# EAGLE design Arduino_4_Layers_TEST (EAGLE 9.6.2)

## Sheet 1 of 3
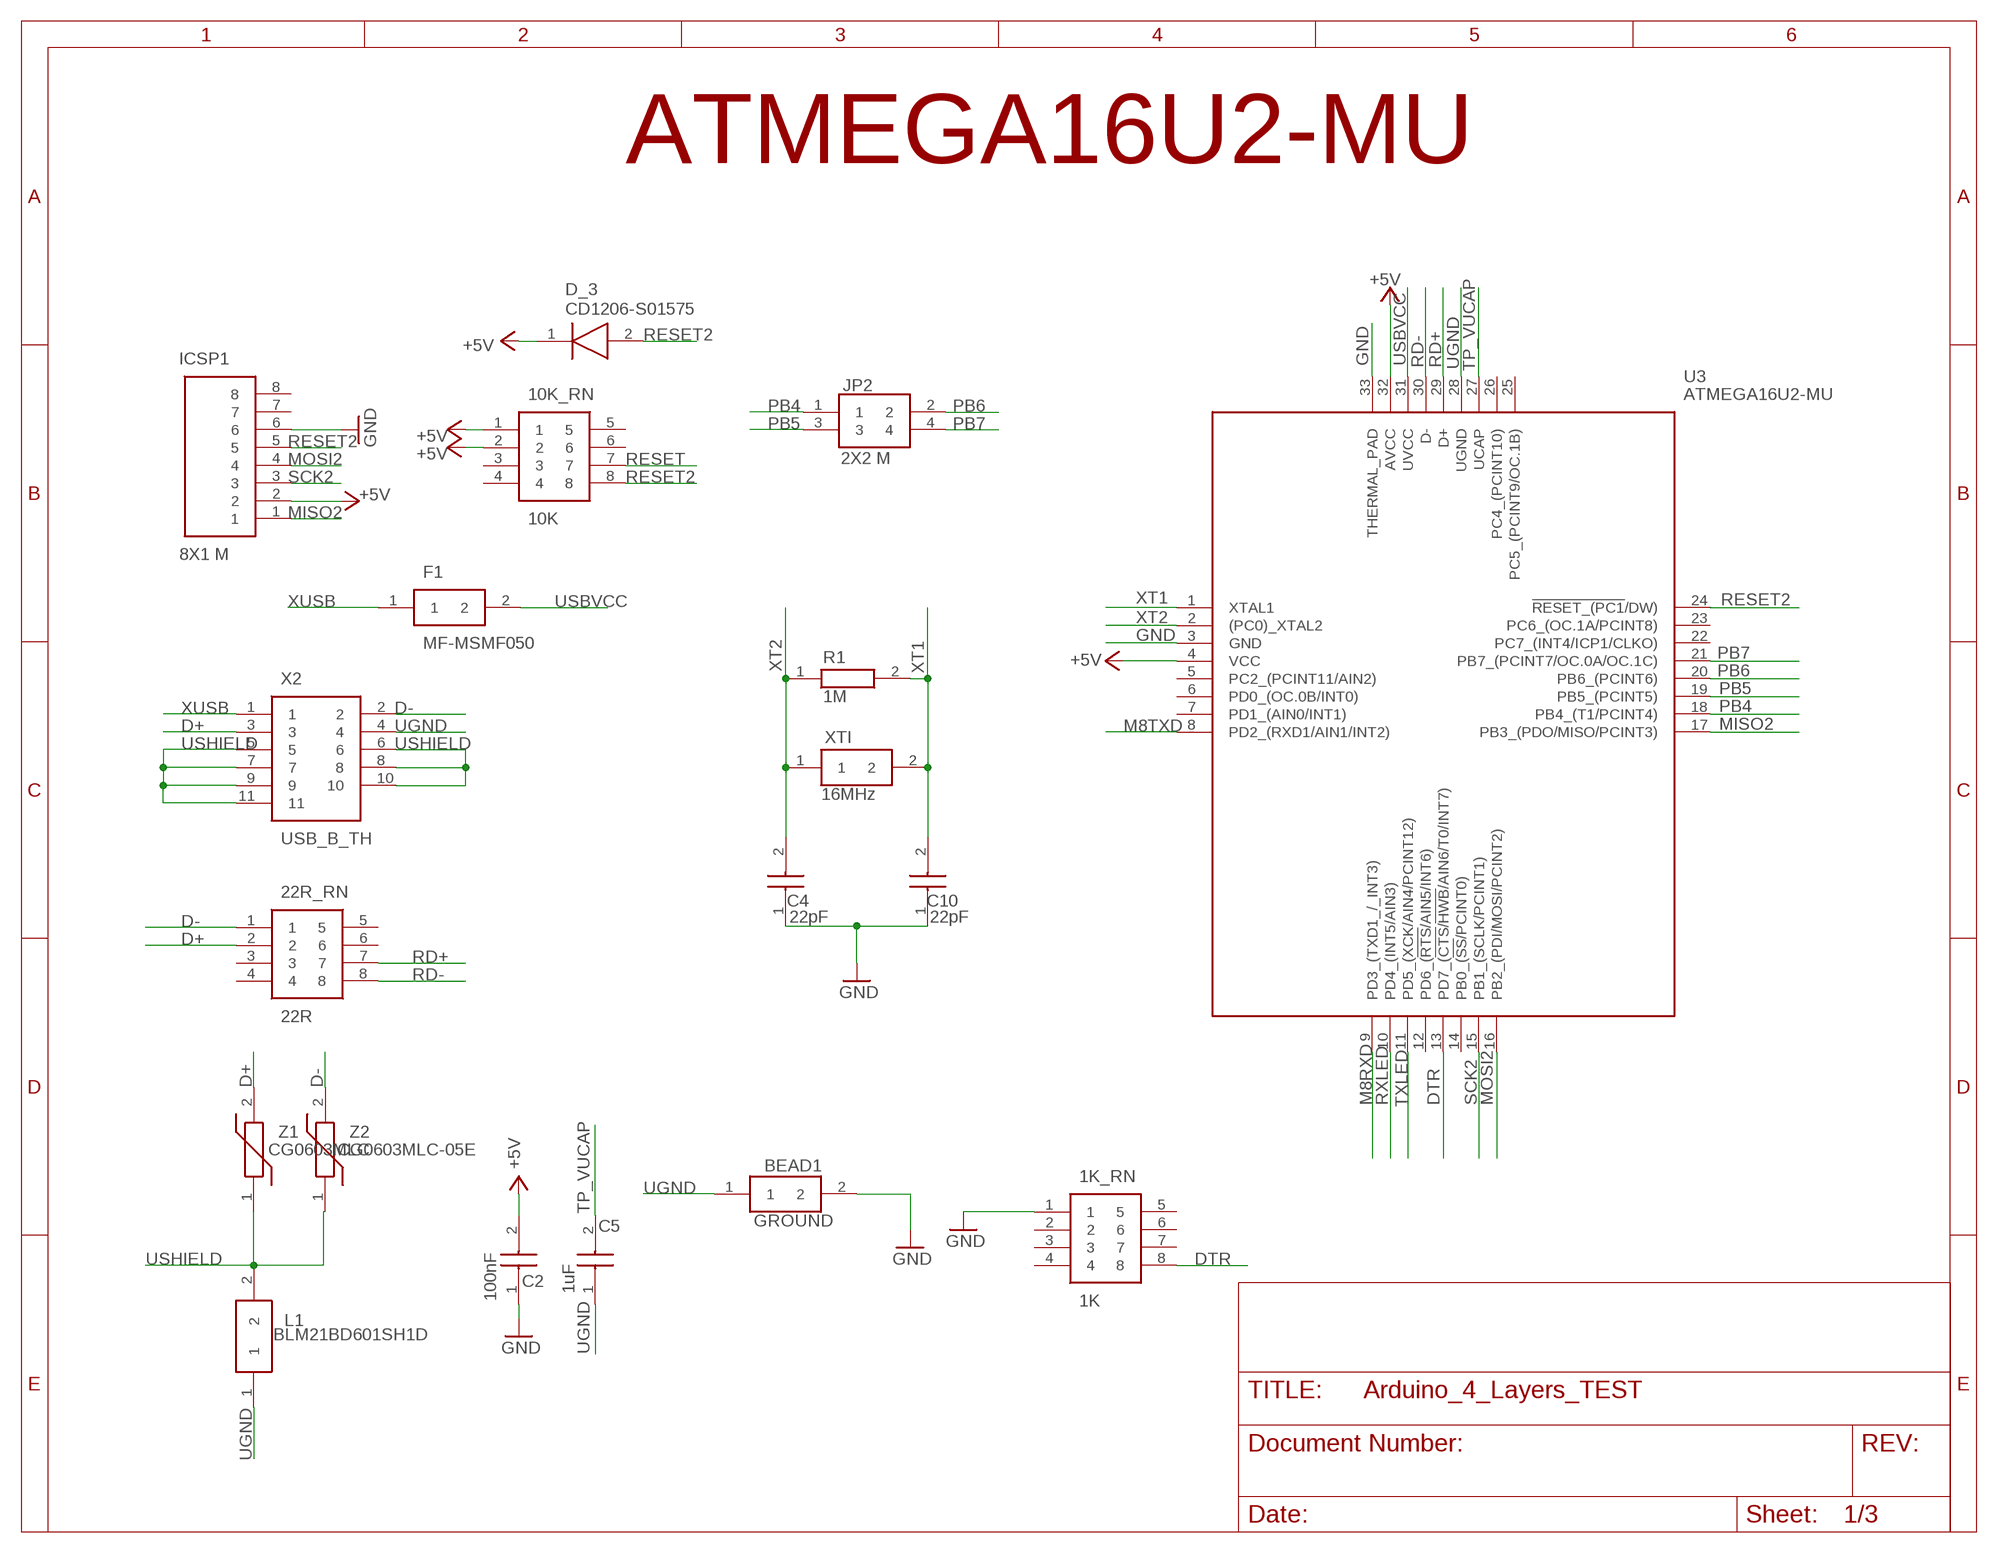
[diagram p0: schematic, sheet 1]

### Parts
1K_RN  1K  CAY10-220J4LF  [CAY10-XXXJ4]
10K_RN  10K  CAY10-220J4LF  [CAY10-XXXJ4]
22R_RN  22R  CAY10-220J4LF  [CAY10-XXXJ4]
BEAD1  GROUND  BLM21BD601SH1D  [BEADC2012X105N]
C2  100nF  0805Y0500104KXT  [CAPC2012X130N]
C4  22pF  GRM2165C1H220JZ01D  [CAPC2012X70N]
C5  1uF  C2012C0G2A103J125AA  [CAPC2012X145N]
C10  22pF  GRM2165C1H220JZ01D  [CAPC2012X70N]
D_3  CD1206-S01575  [DIOC3016X65N]
F1  MF-MSMF050  1812L050_30PR  [FUSC4632X75N]
ICSP1  8X1 M  90120-0768  [HDRV8W90P0X254_1X8_2032X249X56]
JP2  2X2 M  5-146256-2  [HDRV4W77P254_2X2_467X488X821P]
L1  BLM21BD601SH1D  [BEADC2012X105N]
R1  1M  CPF0603B1M0E1  [RESC1608X55N]
U3  ATMEGA16U2-MU  [QFN50P500X500X100-33N]
X2  USB_B_TH  1734035-1  [17340351]
XTI  16MHz  445I35D16M00000  [MODEL-445]
Z1  CG0603MLC  CG0603MLC-05E  [VARC1608X55N]
Z2  CG0603MLC-05E  [VARC1608X55N]

### Nets
+5V: 10K_RN.1 10K_RN.2 C2.2 D_3.1(K) ICSP1.2 U3.4(VCC) U3.32(AVCC) ; also sheet 2,3
D+: 22R_RN.2 X2.3 Z1.2
D-: 22R_RN.1 X2.2 Z2.2
DTR: 1K_RN.8 U3.13(PD7_(!CTS!/!HWB!/AIN6/T0/INT7)) ; also sheet 2
GND: 1K_RN.1 BEAD1.2 C2.1 C4.1 C10.1 ICSP1.6 U3.3(GND) U3.33(THERMAL_PAD) ; also sheet 2,3
M8RXD: U3.9(PD3_(TXD1_/_INT3)) ; also sheet 2
M8TXD: U3.8(PD2_(RXD1/AIN1/INT2)) ; also sheet 2
MISO2: ICSP1.1 U3.17(PB3_(PDO/MISO/PCINT3))
MOSI2: ICSP1.4 U3.16(PB2_(PDI/MOSI/PCINT2))
PB4: JP2.1 U3.18(PB4_(T1/PCINT4))
PB5: JP2.3 U3.19(PB5_(PCINT5))
PB6: JP2.2 U3.20(PB6_(PCINT6))
PB7: JP2.4 U3.21(PB7_(PCINT7/OC.0A/OC.1C))
RD+: 22R_RN.7 U3.29(D+)
RD-: 22R_RN.8 U3.30(D-)
RESET: 10K_RN.7 ; also sheet 2,3
RESET2: 10K_RN.8 D_3.2(A) ICSP1.5 U3.24(!RESET_(PC1!/DW))
RXLED: U3.10(PD4_(INT5/AIN3)) ; also sheet 2
SCK2: ICSP1.3 U3.15(PB1_(SCLK/PCINT1))
TP_VUCAP: C5.2 U3.27(UCAP)
TXLED: U3.11(PD5_(XCK/AIN4/PCINT12)) ; also sheet 2
UGND: BEAD1.1 C5.1 L1.1 U3.28(UGND) X2.4
USBVCC: F1.2 U3.31(UVCC) ; also sheet 3
USHIELD: L1.2 X2.5 X2.6 X2.7 X2.8 X2.9 X2.10 X2.11 Z1.1 Z2.1
XT1: C10.2 R1.2 U3.1(XTAL1) XTI.2
XT2: C4.2 R1.1 U3.2((PC0)_XTAL2) XTI.1
XUSB: F1.1 X2.1
Unconnected: 1K_RN.2 1K_RN.3 1K_RN.4 1K_RN.5 1K_RN.6 1K_RN.7 10K_RN.3 10K_RN.4 10K_RN.5 10K_RN.6 22R_RN.3 22R_RN.4 22R_RN.5 22R_RN.6 ICSP1.7 ICSP1.8 U3.5(PC2_(PCINT11/AIN2)) U3.6(PD0_(OC.0B/INT0)) U3.7(PD1_(AIN0/INT1)) U3.12(PD6_(!RTS!/AIN5/INT6)) U3.14(PB0_(!SS!/PCINT0)) U3.22(PC7_(INT4/ICP1/CLKO)) U3.23(PC6_(OC.1A/PCINT8)) U3.25(PC5_(PCINT9/OC.1B)) U3.26(PC4_(PCINT10))

### Notes on the sheet
- ATMEGA16U2-MU

## Sheet 2 of 3
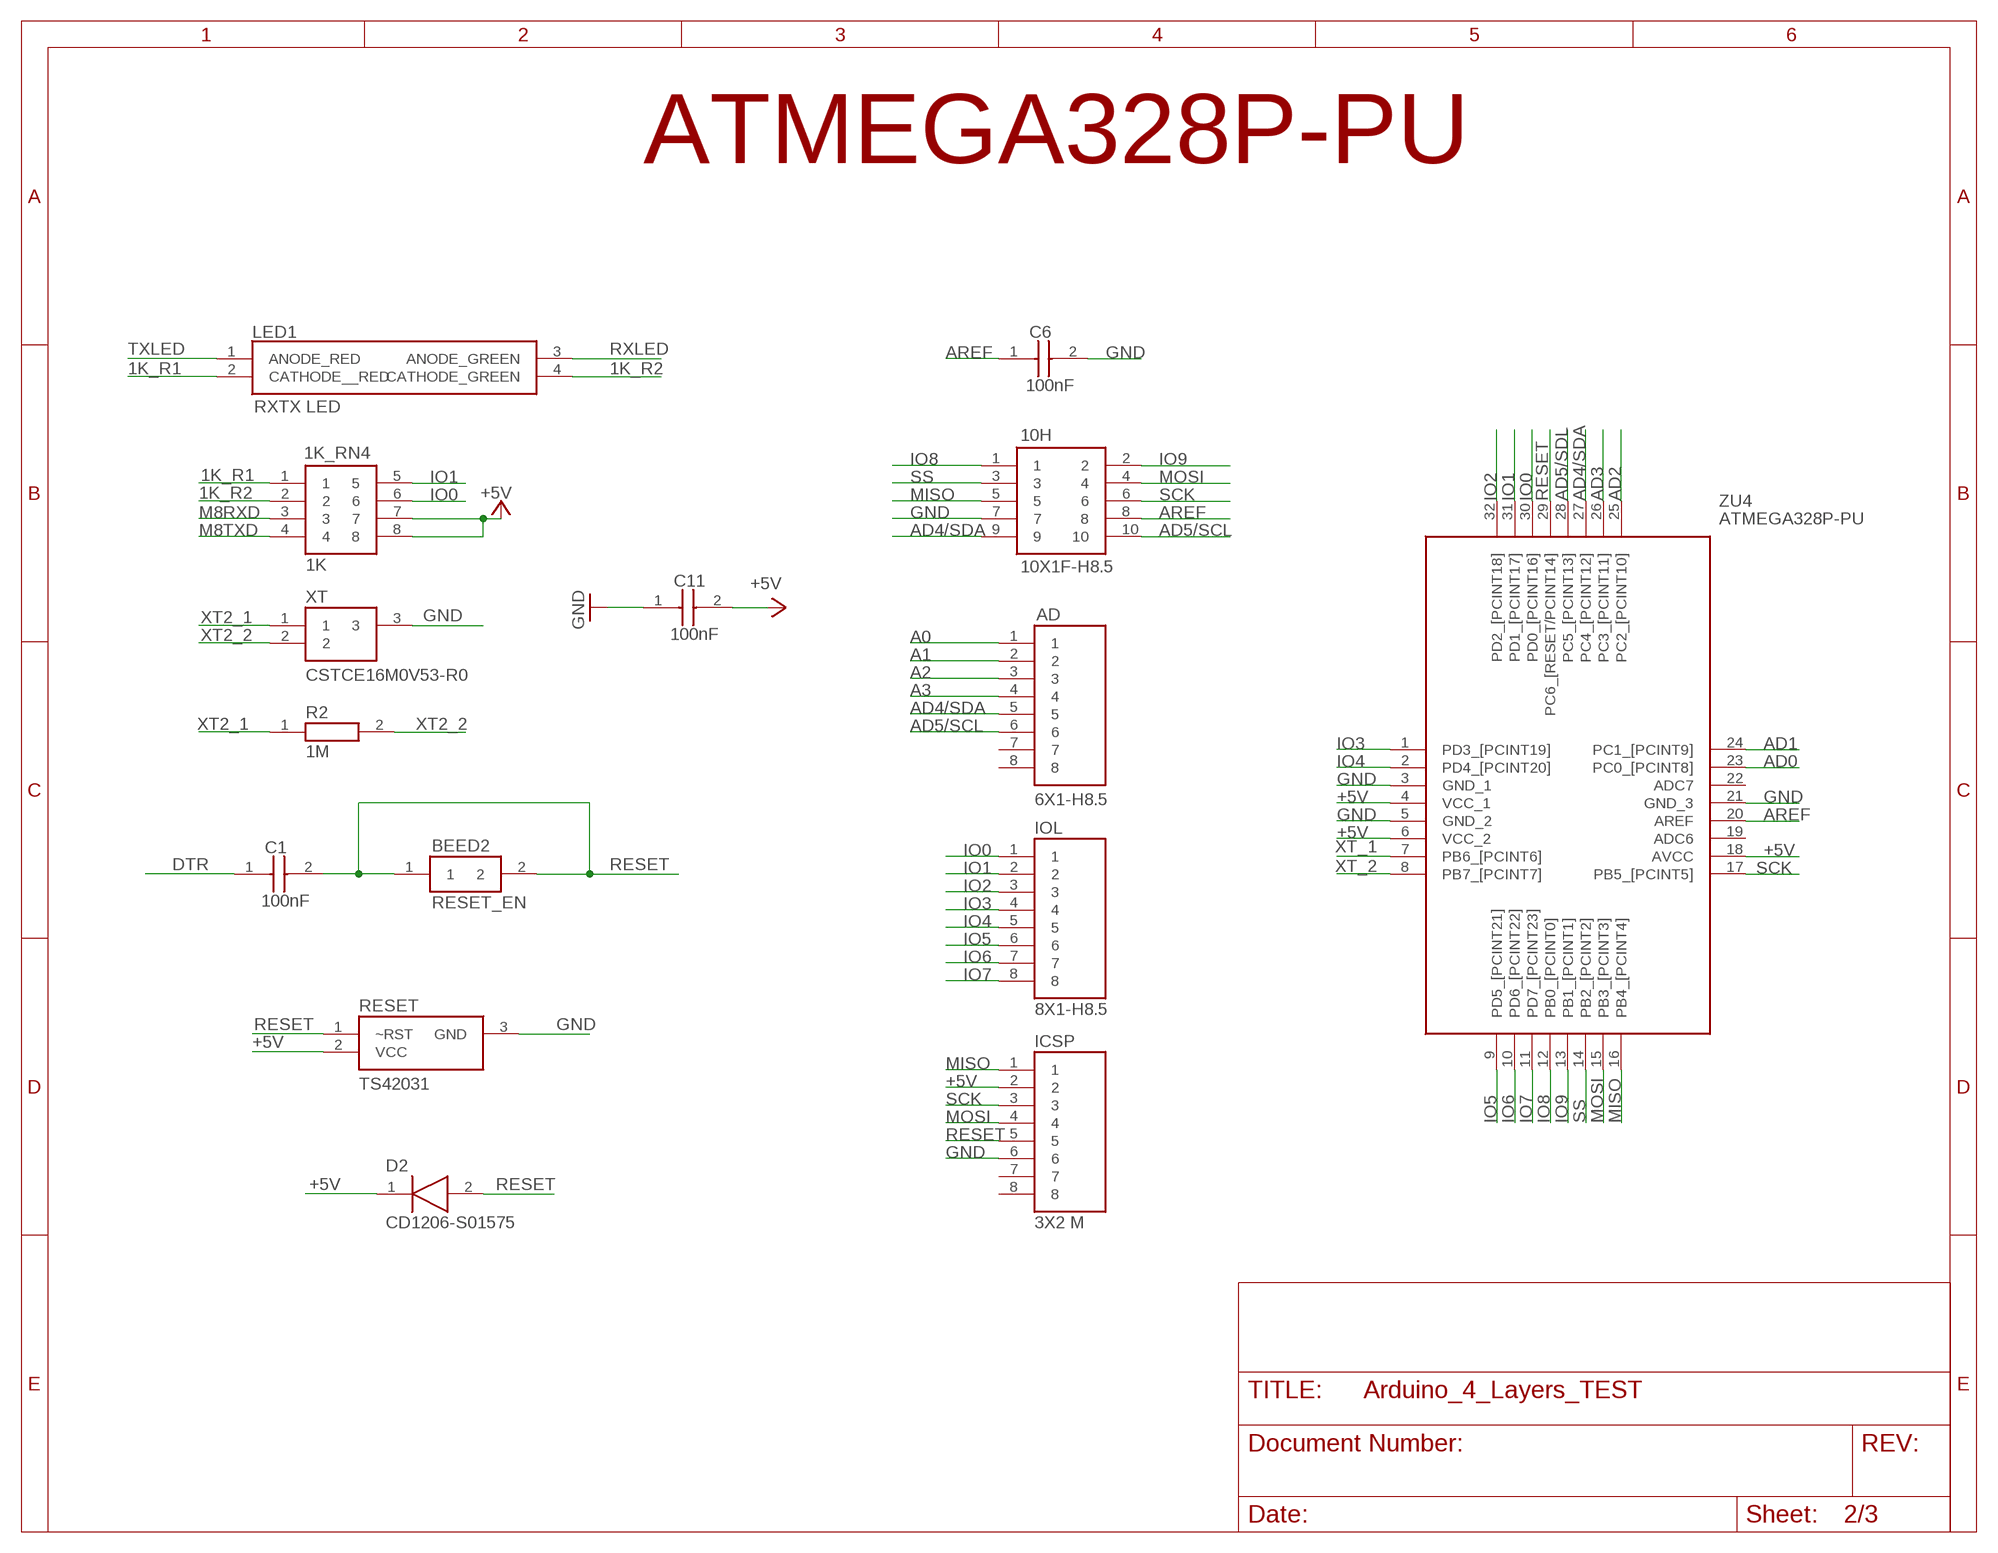
[diagram p1: schematic, sheet 2]

### Parts
1K_RN4  1K  CAY10-220J4LF  [CAY10-XXXJ4]
10H  10X1F-H8.5  FTMH-105-03-L-DV  [FTMH10503LDV]
AD  6X1-H8.5  90120-0768  [HDRV8W90P0X254_1X8_2032X249X56]
BEED2  RESET_EN  BLM21BD601SH1D  [BEADC2012X105N]
C1  100nF  0805Y0500104KXT  [CAPC2012X130N]
C6  100nF  0805Y0500104KXT  [CAPC2012X130N]
C11  100nF  0805Y0500104KXT  [CAPC2012X130N]
D2  CD1206-S01575  [DIOC3016X65N]
ICSP  3X2 M  90120-0768  [HDRV8W90P0X254_1X8_2032X249X56]
IOL  8X1-H8.5  90120-0768  [HDRV8W90P0X254_1X8_2032X249X56]
LED1  RXTX LED  SML-522MU8WT86  [SML522MD8WT86]
R2  1M  CPF0603B1M0E1  [RESC1608X55N]
RESET  TS42031  DS1818R-5+  [SOT95P240X110-3N]
XT  CSTCE16M0V53-R0  [CSTCE-V]
ZU4  ATMEGA328P-PU  ATMEGA328P-AU  [QFP80P900X900X120-32N]

### Nets
1K_R1: 1K_RN4.1 LED1.2(CATHODE__RED)
1K_R2: 1K_RN4.2 LED1.4(CATHODE_GREEN)
+5V: 1K_RN4.7 1K_RN4.8 C11.2 D2.1(K) ICSP.2 RESET.2(VCC) ZU4.4(VCC_1) ZU4.6(VCC_2) ZU4.18(AVCC) ; also sheet 1,3
A0: AD.1
A1: AD.2
A2: AD.3
A3: AD.4
AD0: ZU4.23(PC0_[PCINT8])
AD1: ZU4.24(PC1_[PCINT9])
AD2: ZU4.25(PC2_[PCINT10])
AD3: ZU4.26(PC3_[PCINT11])
AD4/SDA: 10H.9 AD.5 ZU4.27(PC4_[PCINT12])
AD5/SCL: 10H.10 AD.6
AD5/SDL: ZU4.28(PC5_[PCINT13])
AREF: 10H.8 C6.1 ZU4.20(AREF)
DTR: C1.1 ; also sheet 1
GND: 10H.7 C6.2 C11.1 ICSP.6 RESET.3(GND) XT.3 ZU4.3(GND_1) ZU4.5(GND_2) ZU4.21(GND_3) ; also sheet 1,3
IO0: 1K_RN4.6 IOL.1 ZU4.30(PD0_[PCINT16])
IO1: 1K_RN4.5 IOL.2 ZU4.31(PD1_[PCINT17])
IO2: IOL.3 ZU4.32(PD2_[PCINT18])
IO3: IOL.4 ZU4.1(PD3_[PCINT19])
IO4: IOL.5 ZU4.2(PD4_[PCINT20])
IO5: IOL.6 ZU4.9(PD5_[PCINT21])
IO6: IOL.7 ZU4.10(PD6_[PCINT22])
IO7: IOL.8 ZU4.11(PD7_[PCINT23])
IO8: 10H.1 ZU4.12(PB0_[PCINT0])
IO9: 10H.2 ZU4.13(PB1_[PCINT1])
M8RXD: 1K_RN4.3 ; also sheet 1
M8TXD: 1K_RN4.4 ; also sheet 1
MISO: 10H.5 ICSP.1 ZU4.16(PB4_[PCINT4])
MOSI: 10H.4 ICSP.4 ZU4.15(PB3_[PCINT3])
RESET: BEED2.1 BEED2.2 C1.2 D2.2(A) ICSP.5 RESET.1(~RST) ZU4.29(PC6_[RESET/PCINT14]) ; also sheet 1,3
RXLED: LED1.3(ANODE_GREEN) ; also sheet 1
SCK: 10H.6 ICSP.3 ZU4.17(PB5_[PCINT5]) ; also sheet 3
SS: 10H.3 ZU4.14(PB2_[PCINT2])
TXLED: LED1.1(ANODE_RED) ; also sheet 1
XT2_1: R2.1 XT.1
XT2_2: R2.2 XT.2
XT_1: ZU4.7(PB6_[PCINT6])
XT_2: ZU4.8(PB7_[PCINT7])
Unconnected: AD.7 AD.8 ICSP.7 ICSP.8 ZU4.19(ADC6) ZU4.22(ADC7)

### Notes on the sheet
- ATMEGA328P-PU

## Sheet 3 of 3
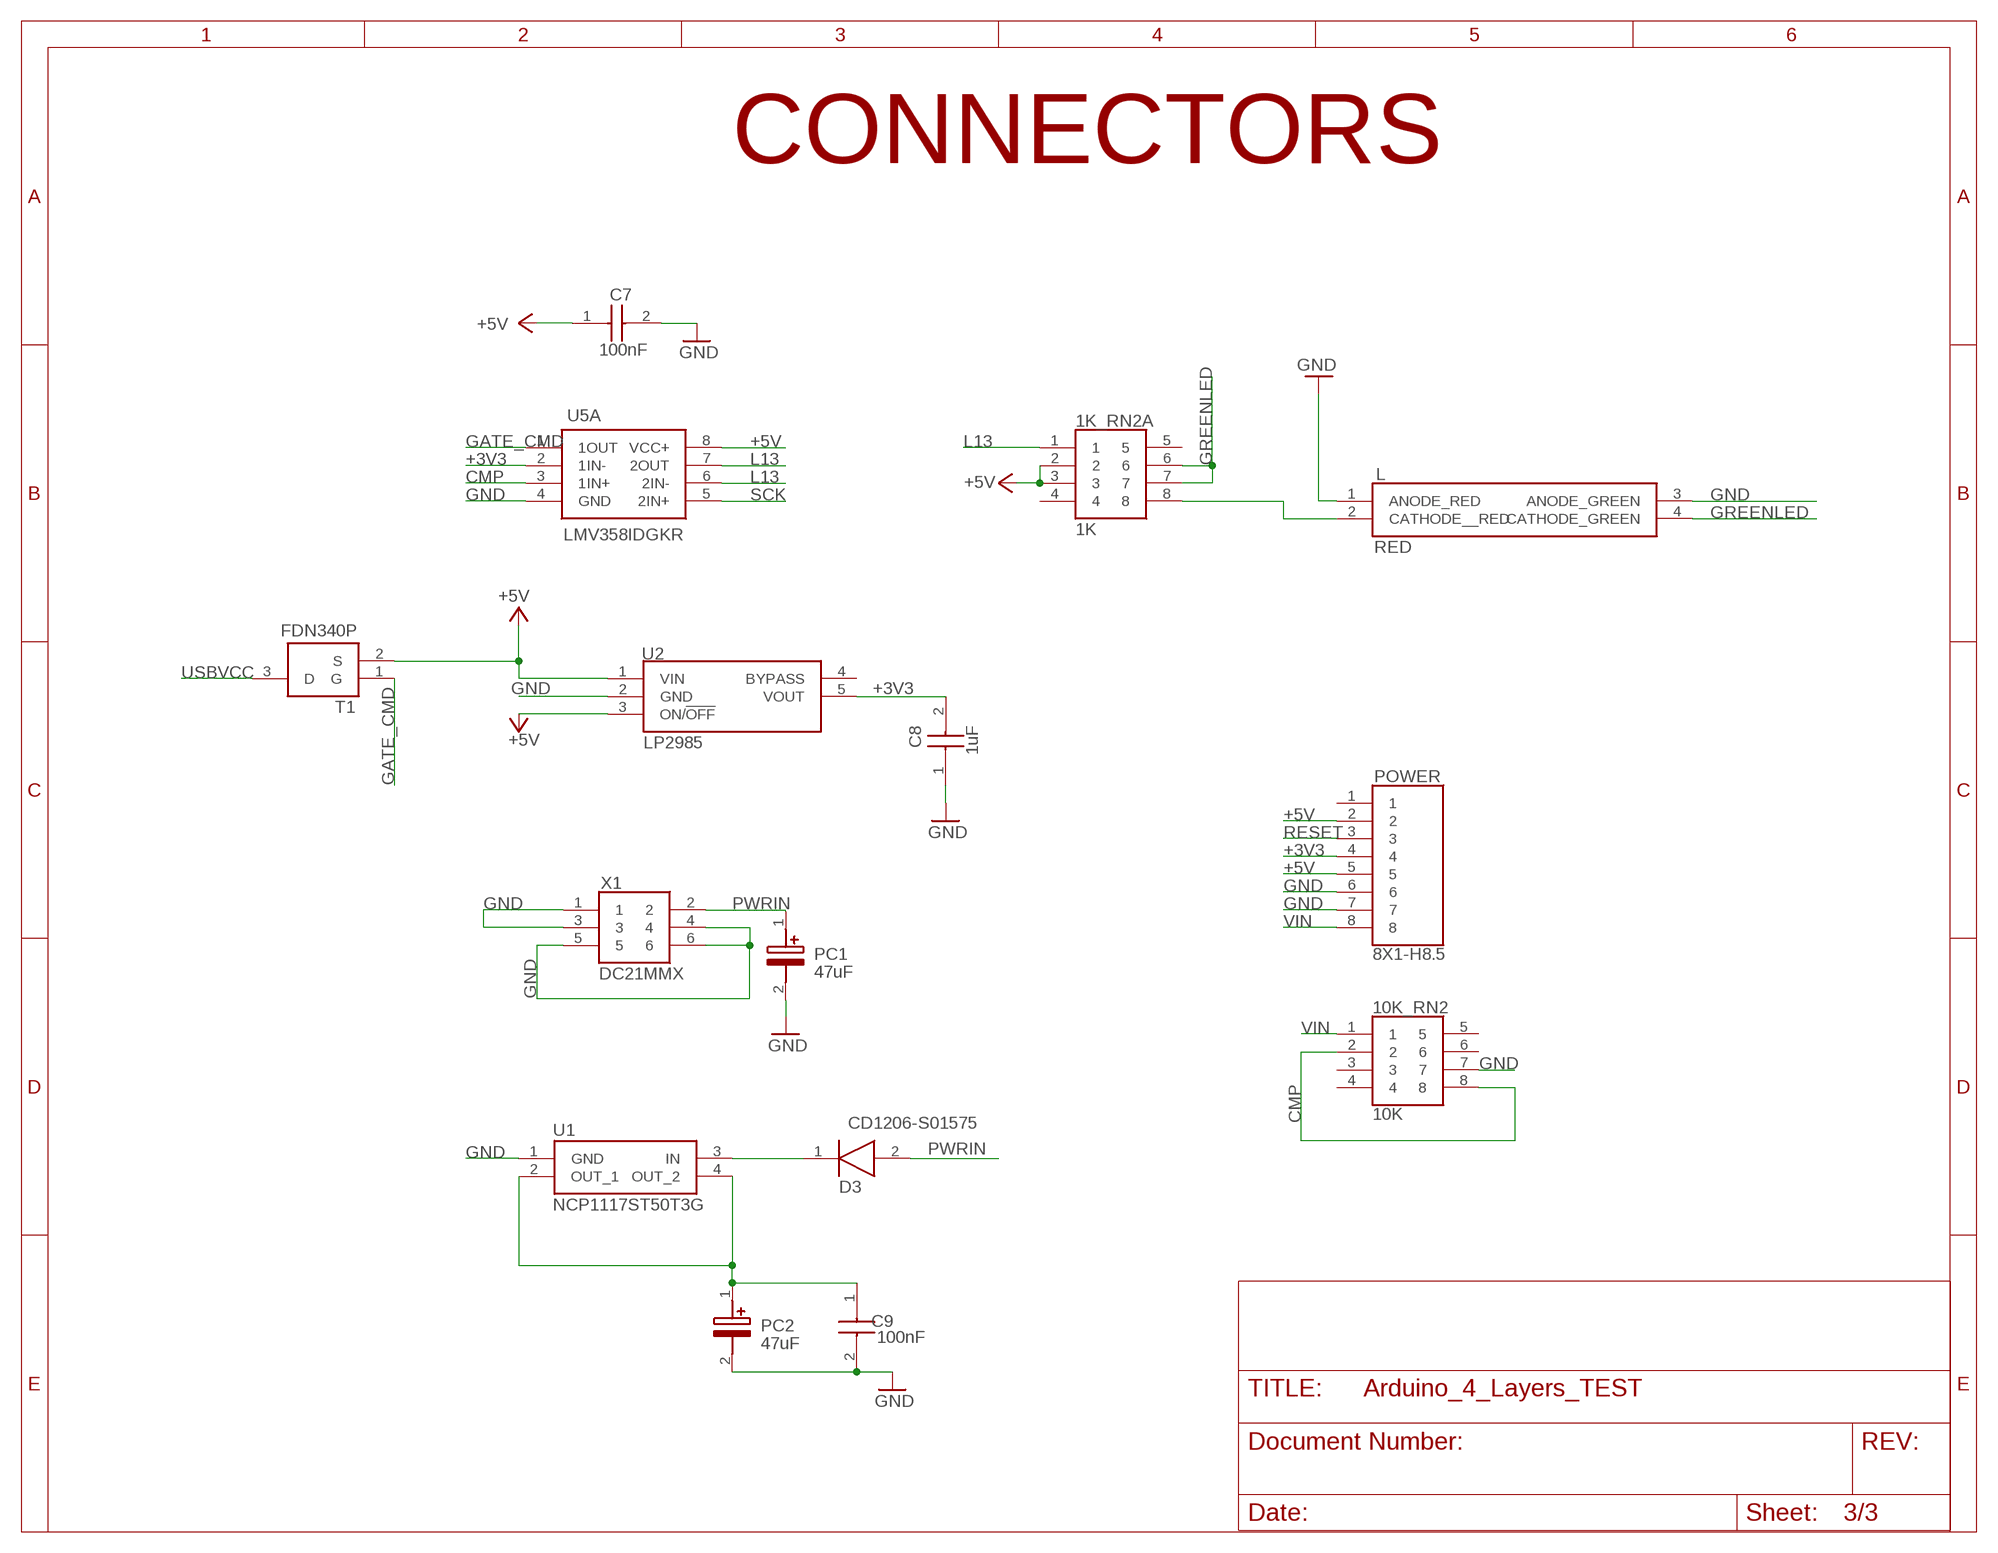
[diagram p2: schematic, sheet 3]

### Parts
1K_RN2A  1K  CAY10-220J4LF  [CAY10-XXXJ4]
10K_RN2  10K  CAY10-220J4LF  [CAY10-XXXJ4]
C7  100nF  0805Y0500104KXT  [CAPC2012X130N]
C8  1uF  C2012C0G2A103J125AA  [CAPC2012X145N]
C9  100nF  0805Y0500104KXT  [CAPC2012X130N]
D3  CD1206-S01575  [DIOC3016X65N]
L  RED  SML-522MU8WT86  [SML522MD8WT86]
PC1  47uF  EEE-FT1V470AR  [CAPAE530X610N]
PC2  47uF  EEE-FT1V470AR  [CAPAE530X610N]
POWER  8X1-H8.5  90120-0768  [HDRV8W90P0X254_1X8_2032X249X56]
T1  FDN340P  [SOT95P251X112-3N]
U1  NCP1117ST50T3G  [SOT230P700X180-4N]
U2  LP2985  LP2985-33DBVR  [SOT95P280X145-5N]
U5A  LMV358IDGKR  [SOP65P490X110-8N]
X1  DC21MMX  USB-B-S-RA  [USBBSRA]

### Nets
+3V3: C8.2 POWER.4 U2.5(VOUT) U5A.2(1IN-)
+5V: 1K_RN2A.2 1K_RN2A.3 C7.1 POWER.2 POWER.5 T1.2(S) U2.1(VIN) U2.3(ON/!OFF) U5A.8(VCC+) ; also sheet 1,2
CMP: 10K_RN2.2 10K_RN2.8 U5A.3(1IN+)
GATE_CMD: T1.1(G) U5A.1(1OUT)
GND: 10K_RN2.7 C7.2 C8.1 C9.2 L.1(ANODE_RED) L.3(ANODE_GREEN) PC1.2(-) PC2.2(-) POWER.6 POWER.7 U1.1(GND) U2.2(GND) U5A.4(GND) X1.1 X1.3 X1.4 X1.5 X1.6 ; also sheet 1,2
GREENLED: 1K_RN2A.6 1K_RN2A.7 L.4(CATHODE_GREEN)
L13: 1K_RN2A.1 U5A.6(2IN-) U5A.7(2OUT)
N$3: 1K_RN2A.8 L.2(CATHODE__RED)
N$4: D3.1(K) U1.3(IN)
N$6: C9.1 PC2.1(+) U1.2(OUT_1) U1.4(OUT_2)
PWRIN: D3.2(A) PC1.1(+) X1.2
RESET: POWER.3 ; also sheet 1,2
SCK: U5A.5(2IN+) ; also sheet 2
USBVCC: T1.3(D) ; also sheet 1
VIN: 10K_RN2.1 POWER.8
Unconnected: 1K_RN2A.4 1K_RN2A.5 10K_RN2.3 10K_RN2.4 10K_RN2.5 10K_RN2.6 POWER.1 U2.4(BYPASS)

### Notes on the sheet
- CONNECTORS

## Library data of the parts
1K_RN 1K_RN2A 1K_RN4 10K_RN 10K_RN2 22R_RN = CAY10-220J4LF:CAY10-220J4LF: CAY10 convex chip resistor array,22R Bourns CAY10 Series 22 5% Isolated SMT Resistor Array, 4 Resistors, 0.125W total 0804 package Convex Source: Datasheet <http://docs-emea.rs-online.com/webdocs/064e/0900766b8064e463.pdf>; ALLIED_NUMBER: 70276318; ALLIED_PRICE-STOCK: https://www.alliedelec.com/bourns-cay10-220j4lf/70276318/; DESCRIPTION: CAY10 convex chip resistor array,22R Bourns CAY10 Series 22 5% Isolated SMT Resistor Array, 4 Resistors, 0.125W total 0804 package Convex; HEIGHT: mm; MANUFACTURER_NAME: Bourns; MANUFACTURER_PART_NUMBER: CAY10-220J4LF; MOUSER_PART_NUMBER: 652-CAY10-220J4LF; MOUSER_PRICE-STOCK: https://www.mouser.com/Search/Refine.aspx?Keyword=652-CAY10-220J4LF; RS_PART_NUMBER: 1674746; RS_PRICE-STOCK: http://uk.rs-online.com/web/p/products/1674746
10H = FTMH-105-03-L-DV:FTMH-105-03-L-DV: Header 1mm PCB SMT vertical 10way Samtec FTMH Series, 1mm Pitch 10 Way 2 Row Straight Pin Header, Surface Mount, Solder Termination Source: Datasheet <http://suddendocs.samtec.com/prints/ftmh-1xx-xx-xx-dv-xx-mkt.pdf>; DESCRIPTION: Header 1mm PCB SMT vertical 10way Samtec FTMH Series, 1mm Pitch 10 Way 2 Row Straight Pin Header, Surface Mount, Solder Termination; HEIGHT: mm; MANUFACTURER_NAME: SAMTEC; MANUFACTURER_PART_NUMBER: FTMH-105-03-L-DV; MOUSER_PART_NUMBER: 200-FTMH10503LDV; MOUSER_PRICE-STOCK: https://www.mouser.com/Search/Refine.aspx?Keyword=200-FTMH10503LDV; RS_PART_NUMBER: 7668984P; RS_PRICE-STOCK: http://uk.rs-online.com/web/p/products/7668984P
AD ICSP ICSP1 IOL POWER = 90120-0768:90120-0768: 8 way single row straight header Molex C-GRID III Series, Series Number 90120, 2.54mm Pitch 8 Way 1 Row Straight Pin Header, Through Hole Source: Datasheet <http://www.molex.com/molex/products/datasheet.jsp?part=active/0901200768_PCB_HEADERS.xml>; ALLIED_NUMBER: 70372836; ALLIED_PRICE-STOCK: https://www.alliedelec.com/molex-incorporated-90120-0768/70372836/; DESCRIPTION: 8 way single row straight header Molex C-GRID III Series, Series Number 90120, 2.54mm Pitch 8 Way 1 Row Straight Pin Header, Through Hole; HEIGHT: 5.6mm; MANUFACTURER_NAME: Molex; MANUFACTURER_PART_NUMBER: 90120-0768; MOUSER_PART_NUMBER: 538-90120-0768; MOUSER_PRICE-STOCK: https://www.mouser.com/Search/Refine.aspx?Keyword=538-90120-0768; RS_PART_NUMBER: 1671900; RS_PRICE-STOCK: http://uk.rs-online.com/web/p/products/1671900
BEAD1 BEED2 L1 = BLM21BD601SH1D:BLM21BD601SH1D: Chip Ferrite Bead 600R 0805 300mA 1LN Source: Datasheet <https://componentsearchengine.com/Datasheets/2/BLM21BD601SH1D.pdf>; DESCRIPTION: Chip Ferrite Bead 600R 0805 300mA 1LN; HEIGHT: 1.05mm; MANUFACTURER_NAME: Murata Electronics; MANUFACTURER_PART_NUMBER: BLM21BD601SH1D; MOUSER_PART_NUMBER: 81-BLM21BD601SH1D; MOUSER_PRICE-STOCK: https://www.mouser.com/Search/Refine.aspx?Keyword=81-BLM21BD601SH1D; RS_PART_NUMBER: 1048541P; RS_PRICE-STOCK: http://uk.rs-online.com/web/p/products/1048541P
C1 C2 C6 C7 C9 C11 = 0805Y0500104KXT:0805Y0500104KXT: Syfer Technology 0805 Flexicap 100nF Ceramic Multilayer Capacitor, 50 V, +125C, X7R Dielectric, 10% SMD Source: Datasheet <http://docs-emea.rs-online.com/webdocs/119d/0900766b8119d7bc.pdf>; DESCRIPTION: Syfer Technology 0805 Flexicap 100nF Ceramic Multilayer Capacitor, 50 V, +125C, X7R Dielectric, 10% SMD; HEIGHT: 1.3mm; MANUFACTURER_NAME: Syfer; MANUFACTURER_PART_NUMBER: 0805Y0500104KXT; MOUSER_PART_NUMBER: 7738389P; MOUSER_PRICE-STOCK: http://uk.rs-online.com/web/p/products/7738389P; RS_PART_NUMBER: 7738389P; RS_PRICE-STOCK: http://uk.rs-online.com/web/p/products/7738389P
C4 C10 = GRM2165C1H220JZ01D:GRM2165C1H220JZ01D: MURATA - GRM2165C1H220JZ01D - CAP, MLCC, C0G/NP0, 22PF, 50V, 0805 Source: Datasheet <http://www.murata.com/~/media/webrenewal/support/library/catalog/products/capacitor/mlcc/c02e.pdf>; DESCRIPTION: MURATA - GRM2165C1H220JZ01D - CAP, MLCC, C0G/NP0, 22PF, 50V, 0805; HEIGHT: 0.7mm; MANUFACTURER_NAME: Murata Electronics; MANUFACTURER_PART_NUMBER: GRM2165C1H220JZ01D; MOUSER_PART_NUMBER: 81-GRM2165C1H220JZ; MOUSER_PRICE-STOCK: https://www.mouser.com/Search/Refine.aspx?Keyword=81-GRM2165C1H220JZ; RS_PART_NUMBER: 7236243; RS_PRICE-STOCK: http://uk.rs-online.com/web/p/products/7236243
C5 C8 = C2012C0G2A103J125AA:C2012C0G2A103J125AA: Multilayer Ceramic Capacitors MLCC - SMD/SMT 0805 C0G 100volts 0.01uF 5% 1.25mm Source: Datasheet <https://product.tdk.com/info/en/catalog/datasheets/mlcc_commercial_midvoltage_en.pdf>; DESCRIPTION: Multilayer Ceramic Capacitors MLCC - SMD/SMT 0805 C0G 100volts 0.01uF 5% 1.25mm; HEIGHT: 1.45mm; MANUFACTURER_NAME: TDK; MANUFACTURER_PART_NUMBER: C2012C0G2A103J125AA; MOUSER_PART_NUMBER: 810-C2012C0G2A103JAA; MOUSER_PRICE-STOCK: https://www.mouser.com/Search/Refine.aspx?Keyword=810-C2012C0G2A103JAA
D2 D3 D_3 = CD1206-S01575:CD1206-S01575: Diode Switching 100V 0.15A 4ns SMD1206 Bourns CD1206-S01575 Switching Diode, 150mA, 100V, 4ns, 2-Pin 1206 Source: Datasheet <http://docs-emea.rs-online.com/webdocs/1189/0900766b811897a9.pdf>; ALLIED_NUMBER: 70154675; ALLIED_PRICE-STOCK: http://www.alliedelec.com/bourns-cd1206-s01575/70154675/; DESCRIPTION: Diode Switching 100V 0.15A 4ns SMD1206 Bourns CD1206-S01575 Switching Diode, 150mA, 100V, 4ns, 2-Pin 1206; HEIGHT: 0.65mm; MANUFACTURER_NAME: Bourns; MANUFACTURER_PART_NUMBER: CD1206-S01575; MOUSER_PART_NUMBER: 652-CD1206-S01575; MOUSER_PRICE-STOCK: https://www.mouser.com/Search/Refine.aspx?Keyword=652-CD1206-S01575; RS_PART_NUMBER: 1775431; RS_PRICE-STOCK: http://uk.rs-online.com/web/p/products/1775431
F1 = 1812L050_30PR:1812L050_30PR: Littelfuse 0.5A Resettable Surface Mount Fuse, 30V dc Source: Datasheet <https://www.arrow.com/en/products/1812l05030pr/littelfuse>; DESCRIPTION: Littelfuse 0.5A Resettable Surface Mount Fuse, 30V dc; HEIGHT: 0.75mm; MANUFACTURER_NAME: LITTELFUSE; MANUFACTURER_PART_NUMBER: 1812L050/30PR; MOUSER_PART_NUMBER: 576-1812L050/30PR; MOUSER_PRICE-STOCK: https://www.mouser.com/Search/Refine.aspx?Keyword=576-1812L050%2F30PR; RS_PART_NUMBER: 8951631P; RS_PRICE-STOCK: http://uk.rs-online.com/web/p/products/8951631P
JP2 = 5-146256-2:5-146256-2: AMP - TE CONNECTIVITY - 5-146256-2 - CONNECTOR, HEADER, 4 POSITION, 2ROWS, 2.54MM Source: Datasheet <http://www.mouser.com/ds/2/418/NG_CD_146256_H-649289.pdf>; ALLIED_NUMBER: 70085239; ALLIED_PRICE-STOCK: https://www.alliedelec.com/te-connectivity-5-146256-2/70085239/; DESCRIPTION: AMP - TE CONNECTIVITY - 5-146256-2 - CONNECTOR, HEADER, 4 POSITION, 2ROWS, 2.54MM; HEIGHT: 8.21mm; MANUFACTURER_NAME: TE Connectivity; MANUFACTURER_PART_NUMBER: 5-146256-2; MOUSER_PART_NUMBER: 571-5-146256-2; MOUSER_PRICE-STOCK: https://www.mouser.com/Search/Refine.aspx?Keyword=571-5-146256-2; RS_PART_NUMBER: 7972955; RS_PRICE-STOCK: http://uk.rs-online.com/web/p/products/7972955
L LED1 = SML-522MU8WT86:SML-522MU8WT86: Dual color mini-mold Chip LED: ROHM's chip LED lineup consists of standard type,top-view type, side-view type and reverse-mount type. Source: Datasheet <https://www.rohm.com/datasheet/SML-522MU8W/sml-52-e>; DESCRIPTION: Dual color mini-mold Chip LED: ROHM's chip LED lineup consists of standard type,top-view type, side-view type and reverse-mount type.; HEIGHT: 0mm; MANUFACTURER_NAME: ROHM Semiconductor; MANUFACTURER_PART_NUMBER: SML-522MU8WT86; MOUSER_PART_NUMBER: 755-SML-522MU8WT86; MOUSER_PRICE-STOCK: https://www.mouser.com/Search/Refine.aspx?Keyword=755-SML-522MU8WT86; RS_PART_NUMBER: 1682468; RS_PRICE-STOCK: http://uk.rs-online.com/web/p/products/1682468
PC1 PC2 = EEE-FT1V470AR:EEE-FT1V470AR: Aluminum Electrolytic Capacitors - SMD 47uF 35volts 5x5.8mm SMD Source: Datasheet <https://industrial.panasonic.com/cdbs/www-data/pdf/RDE0000/ABA0000C1240.pdf>; ALLIED_NUMBER: 70258388; ALLIED_PRICE-STOCK: https://www.alliedelec.com/panasonic-eee-ft1v470ar/70258388/; DESCRIPTION: Aluminum Electrolytic Capacitors - SMD 47uF 35volts 5x5.8mm SMD; HEIGHT: 6.1mm; MANUFACTURER_NAME: Panasonic; MANUFACTURER_PART_NUMBER: EEE-FT1V470AR; MOUSER_PART_NUMBER: 667-EEE-FT1V470AR; MOUSER_PRICE-STOCK: https://www.mouser.com/Search/Refine.aspx?Keyword=667-EEE-FT1V470AR
R1 R2 = CPF0603B1M0E1:CPF0603B1M0E1: TE CONNECTIVITY - CPF0603B1M0E1 - RES, THIN FILM, 1M, 0.1%, 0.063W, 0603 Source: Datasheet <http://www.farnell.com/datasheets/1786775.pdf>; DESCRIPTION: TE CONNECTIVITY - CPF0603B1M0E1 - RES, THIN FILM, 1M, 0.1%, 0.063W, 0603; HEIGHT: 0.55mm; MANUFACTURER_NAME: TE Connectivity; MANUFACTURER_PART_NUMBER: CPF0603B1M0E1; MOUSER_PART_NUMBER: 279-CPF0603B1M0E1; MOUSER_PRICE-STOCK: https://www.mouser.com/Search/Refine.aspx?Keyword=279-CPF0603B1M0E1
RESET = DS1818R-5+:DS1818R-5+: 3.3V EconoReset with Pushbutton Source: Datasheet; DESCRIPTION: 3.3V EconoReset with Pushbutton; HEIGHT: mm; MANUFACTURER_NAME: Maxim Integrated; MANUFACTURER_PART_NUMBER: DS1818R-5+
T1 = FDN340P:FDN340P: FDN340P, P-channel MOSFET Transistor 2 A 20 V, 3-Pin SuperSOT Source: Datasheet <http://docs-emea.rs-online.com/webdocs/0d23/0900766b80d23111.pdf>; DESCRIPTION: FDN340P, P-channel MOSFET Transistor 2 A 20 V, 3-Pin SuperSOT; HEIGHT: 1.12mm; MANUFACTURER_NAME: Fairchild Semiconductor; MANUFACTURER_PART_NUMBER: FDN340P; MOUSER_PART_NUMBER: 512-FDN340P; MOUSER_PRICE-STOCK: https://www.mouser.com/Search/Refine.aspx?Keyword=512-FDN340P; RS_PART_NUMBER: 6710435P; RS_PRICE-STOCK: http://uk.rs-online.com/web/p/products/6710435P
U1 = NCP1117ST50T3G:NCP1117ST50T3G: ON SEMICONDUCTOR - NCP1117ST50T3G - LDO, REG, 20VIN, 1A, 5V, 1%, SOT223-3 Source: Datasheet <http://www.onsemi.com/pub/Collateral/NCP1117-D.PDF>; ALLIED_NUMBER: 70466898; ALLIED_PRICE-STOCK: http://www.alliedelec.com/on-semiconductor-ncp1117st50t3g/70466898/; DESCRIPTION: ON SEMICONDUCTOR - NCP1117ST50T3G - LDO, REG, 20VIN, 1A, 5V, 1%, SOT223-3; HEIGHT: 1.8mm; MANUFACTURER_NAME: ON Semiconductor; MANUFACTURER_PART_NUMBER: NCP1117ST50T3G; MOUSER_PART_NUMBER: 863-NCP1117ST50T3G; MOUSER_PRICE-STOCK: https://www.mouser.com/Search/Refine.aspx?Keyword=863-NCP1117ST50T3G; RS_PART_NUMBER: 8022130P; RS_PRICE-STOCK: http://uk.rs-online.com/web/p/products/8022130P
U2 = LP2985-33DBVR:LP2985-33DBVR: 150-mA Low-noise Low-dropout Regulator With Shutdown Source: Datasheet <http://www.ti.com/lit/gpn/lp2985>; DESCRIPTION: 150-mA Low-noise Low-dropout Regulator With Shutdown; HEIGHT: 1.45mm; MANUFACTURER_NAME: Texas Instruments; MANUFACTURER_PART_NUMBER: LP2985-33DBVR; MOUSER_PART_NUMBER: 595-LP2985-33DBVR; MOUSER_PRICE-STOCK: https://www.mouser.com/Search/Refine.aspx?Keyword=595-LP2985-33DBVR
U3 = ATMEGA16U2-MU:ATMEGA16U2-MU: 8-bit Microcontrollers - MCU AVR USB 8K FLASH AVR USB 16K FLASH Source: Datasheet <http://ww1.microchip.com/downloads/en/DeviceDoc/doc7799.pdf>; DESCRIPTION: 8-bit Microcontrollers - MCU AVR USB 8K FLASH AVR USB 16K FLASH; HEIGHT: 1mm; MANUFACTURER_NAME: Microchip; MANUFACTURER_PART_NUMBER: ATMEGA16U2-MU; MOUSER_PART_NUMBER: 556-ATMEGA16U2-MU; MOUSER_PRICE-STOCK: https://www.mouser.com/Search/Refine.aspx?Keyword=556-ATMEGA16U2-MU; RS_PART_NUMBER: 1717746; RS_PRICE-STOCK: http://uk.rs-online.com/web/p/products/1717746
U5A = LMV358IDGKR:LMV358IDGKR: OP Amp Dual GP R-R O/P 5.5V 8-Pin MSOP Texas Instruments LMV358IDGKR, Dual Op Amp, 1MHz CMOS, Rail to Rail, 3 V, 5 V, 8-Pin MSOP Source: Datasheet <http://www.ti.com/lit/ds/symlink/lmv358.pdf>; DESCRIPTION: OP Amp Dual GP R-R O/P 5.5V 8-Pin MSOP Texas Instruments LMV358IDGKR, Dual Op Amp, 1MHz CMOS, Rail to Rail, 3 V, 5 V, 8-Pin MSOP; HEIGHT: 1.1mm; MANUFACTURER_NAME: Texas Instruments; MANUFACTURER_PART_NUMBER: LMV358IDGKR; MOUSER_PART_NUMBER: 595-LMV358IDGKR; MOUSER_PRICE-STOCK: https://www.mouser.com/Search/Refine.aspx?Keyword=595-LMV358IDGKR; RS_PART_NUMBER: 1625114; RS_PRICE-STOCK: http://uk.rs-online.com/web/p/products/1625114
X1 = USB-B-S-RA:USB-B-S-RA: MULTICOMP - USB-B-S-RA - USB, 2.0 TYPE B, RECEPTACLE, TH Source: Datasheet <http://www.farnell.com/datasheets/1788391.pdf>; DESCRIPTION: MULTICOMP - USB-B-S-RA - USB, 2.0 TYPE B, RECEPTACLE, TH; HEIGHT: 10mm; MANUFACTURER_NAME: MULTICOMP; MANUFACTURER_PART_NUMBER: USB-B-S-RA
X2 = 1734035-1:1734035-1: AMP - TE CONNECTIVITY - 1734035-1. - MINI USB, 2.0 TYPE B, RECEPTACLE, SMT Source: Datasheet <http://www.te.com/commerce/DocumentDelivery/DDEController?Action=srchrtrv&DocNm=1734035&DocType=Customer Drawing&DocLang=English>; ALLIED_NUMBER: 70086812; ALLIED_PRICE-STOCK: https://www.alliedelec.com/te-connectivity-1734035-1/70086812/; DESCRIPTION: AMP - TE CONNECTIVITY - 1734035-1. - MINI USB, 2.0 TYPE B, RECEPTACLE, SMT; HEIGHT: 4mm; MANUFACTURER_NAME: TE Connectivity; MANUFACTURER_PART_NUMBER: 1734035-1; MOUSER_PART_NUMBER: 571-1734035-1; MOUSER_PRICE-STOCK: https://www.mouser.com/Search/Refine.aspx?Keyword=571-1734035-1
XT = CSTCE16M0V53-R0:CSTCE16M0V53-R0: Ceramic resonator SMT CSTCE 16.00MHz CSTCE16M0V53-R0, Ceramic Resonator, 16MHz Expander 15pF, 3-Pin Cap Chip, 3.2 x 1.3 x 0.9mm Source: Datasheet <http://uk.rs-online.com/web/p/products/6241077>; DESCRIPTION: Ceramic resonator SMT CSTCE 16.00MHz CSTCE16M0V53-R0, Ceramic Resonator, 16MHz Expander 15pF, 3-Pin Cap Chip, 3.2 x 1.3 x 0.9mm; HEIGHT: mm; MANUFACTURER_NAME: Murata Electronics; MANUFACTURER_PART_NUMBER: CSTCE16M0V53-R0; MOUSER_PART_NUMBER: 81-CSTCE16M0V53-R0; MOUSER_PRICE-STOCK: https://www.mouser.com/Search/Refine.aspx?Keyword=81-CSTCE16M0V53-R0; RS_PART_NUMBER: 7926524P; RS_PRICE-STOCK: http://uk.rs-online.com/web/p/products/7926524P
XTI = 445I35D16M00000:445I35D16M00000: Crystals 16MHz +/-30ppm 18pF -40C +85C Source: Datasheet <http://www.mouser.com/ds/2/96/008-0360-0-786290.pdf>; DESCRIPTION: Crystals 16MHz +/-30ppm 18pF -40C +85C; HEIGHT: mm; MANUFACTURER_NAME: CTS; MANUFACTURER_PART_NUMBER: 445I35D16M00000; MOUSER_PART_NUMBER: 774-445I35D16M00000; MOUSER_PRICE-STOCK: https://www.mouser.com/Search/Refine.aspx?Keyword=774-445I35D16M00000
Z1 Z2 = CG0603MLC-05E:CG0603MLC-05E: Varistor, ESD Protector, 5VDC,20V,0603 Bourns MLC Series Power Varistor 0.5pF 20V 0603 Case Source: Datasheet <http://www.farnell.com/datasheets/1785244.pdf>; ALLIED_NUMBER: 70153503; ALLIED_PRICE-STOCK: https://www.alliedelec.com/bourns-cg0603mlc-05e/70153503/; DESCRIPTION: Varistor, ESD Protector, 5VDC,20V,0603 Bourns MLC Series Power Varistor 0.5pF 20V 0603 Case; HEIGHT: 0.55mm; MANUFACTURER_NAME: Bourns; MANUFACTURER_PART_NUMBER: CG0603MLC-05E; MOUSER_PART_NUMBER: 652-CG0603MLC-05E; MOUSER_PRICE-STOCK: https://www.mouser.com/Search/Refine.aspx?Keyword=652-CG0603MLC-05E; RS_PART_NUMBER: 8518256; RS_PRICE-STOCK: http://uk.rs-online.com/web/p/products/8518256
ZU4 = ATMEGA328P-AU:ATMEGA328P-AU: MICROCHIP - ATMEGA328P-AU. - MICROCONTROLLER MCU, 8 BIT, ATMEGA, 20MHZ, TQFP-32 Source: Datasheet <https://componentsearchengine.com/Datasheets/2/ATMEGA328P-AU.pdf>; DESCRIPTION: MICROCHIP - ATMEGA328P-AU. - MICROCONTROLLER MCU, 8 BIT, ATMEGA, 20MHZ, TQFP-32; HEIGHT: 1.2mm; MANUFACTURER_NAME: Microchip; MANUFACTURER_PART_NUMBER: ATMEGA328P-AU; MOUSER_PART_NUMBER: 556-ATMEGA328P-AU; MOUSER_PRICE-STOCK: https://www.mouser.com/Search/Refine.aspx?Keyword=556-ATMEGA328P-AU; RS_PART_NUMBER: 1310271; RS_PRICE-STOCK: http://uk.rs-online.com/web/p/products/1310271

## Board
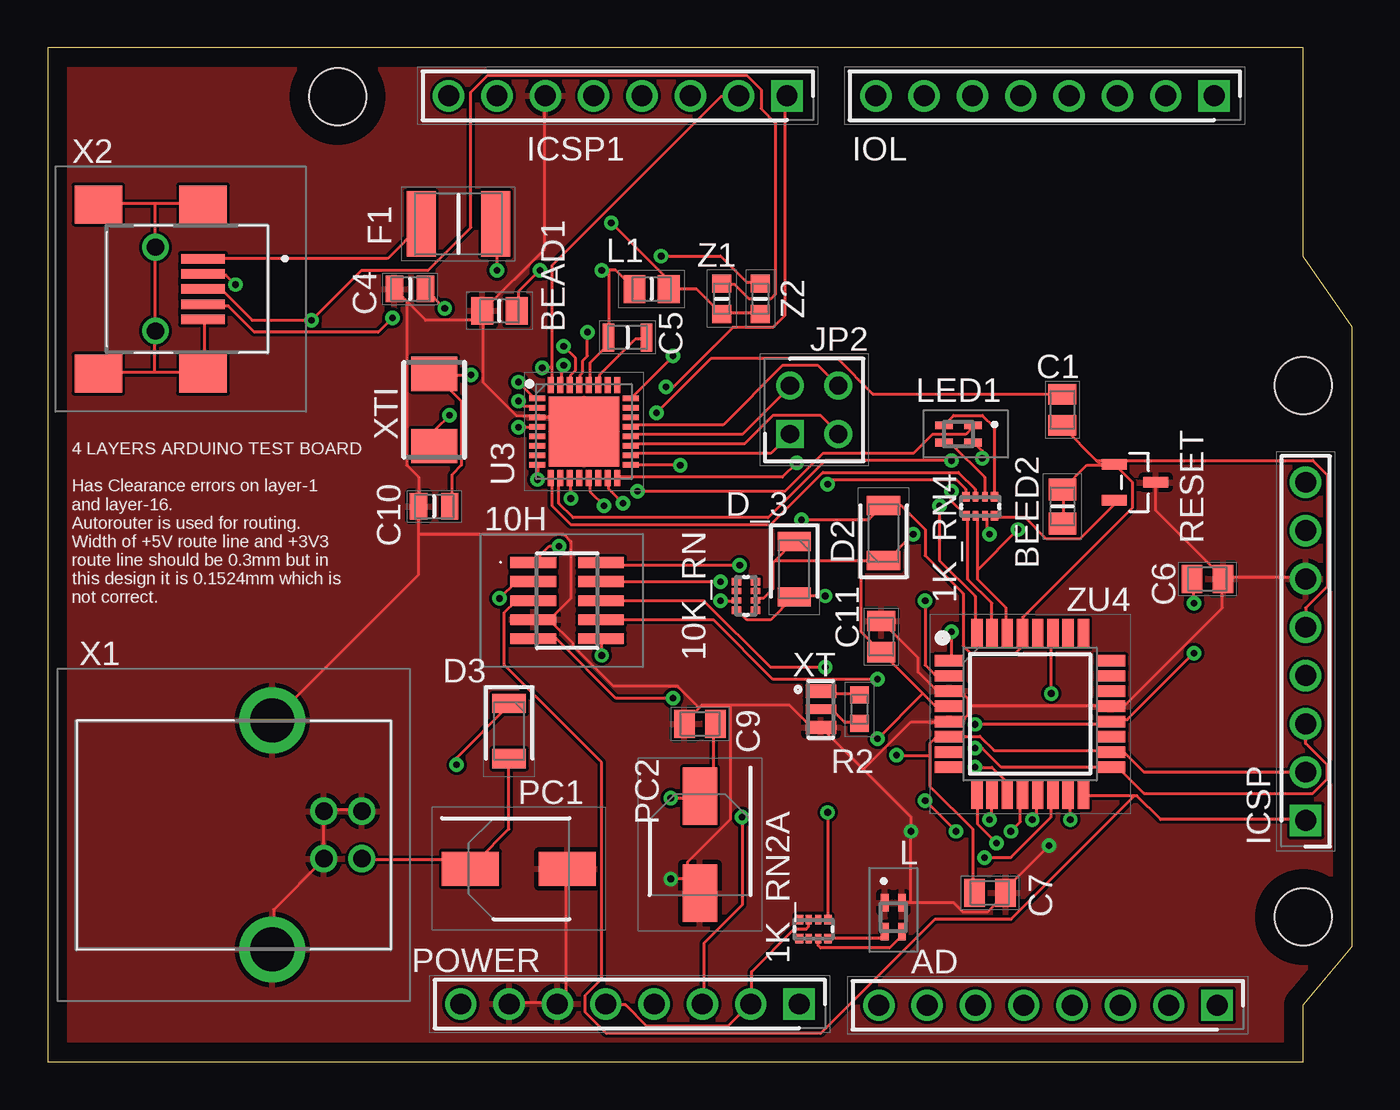
[diagram p3: board, top side]
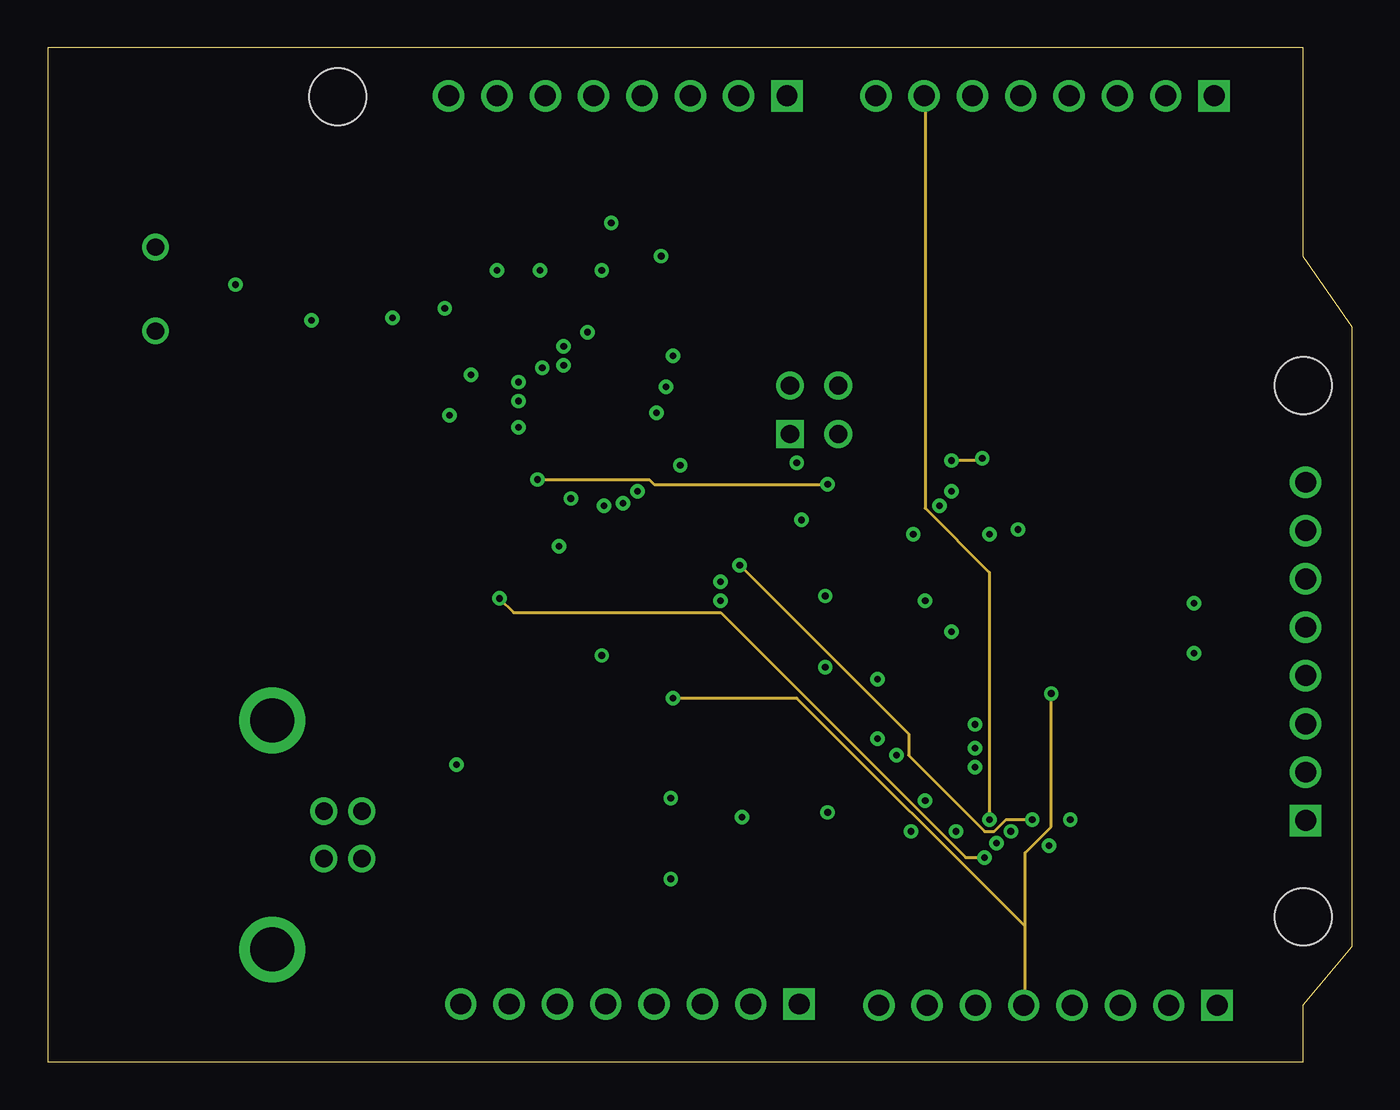
[diagram p4: board, inner layer Route2]
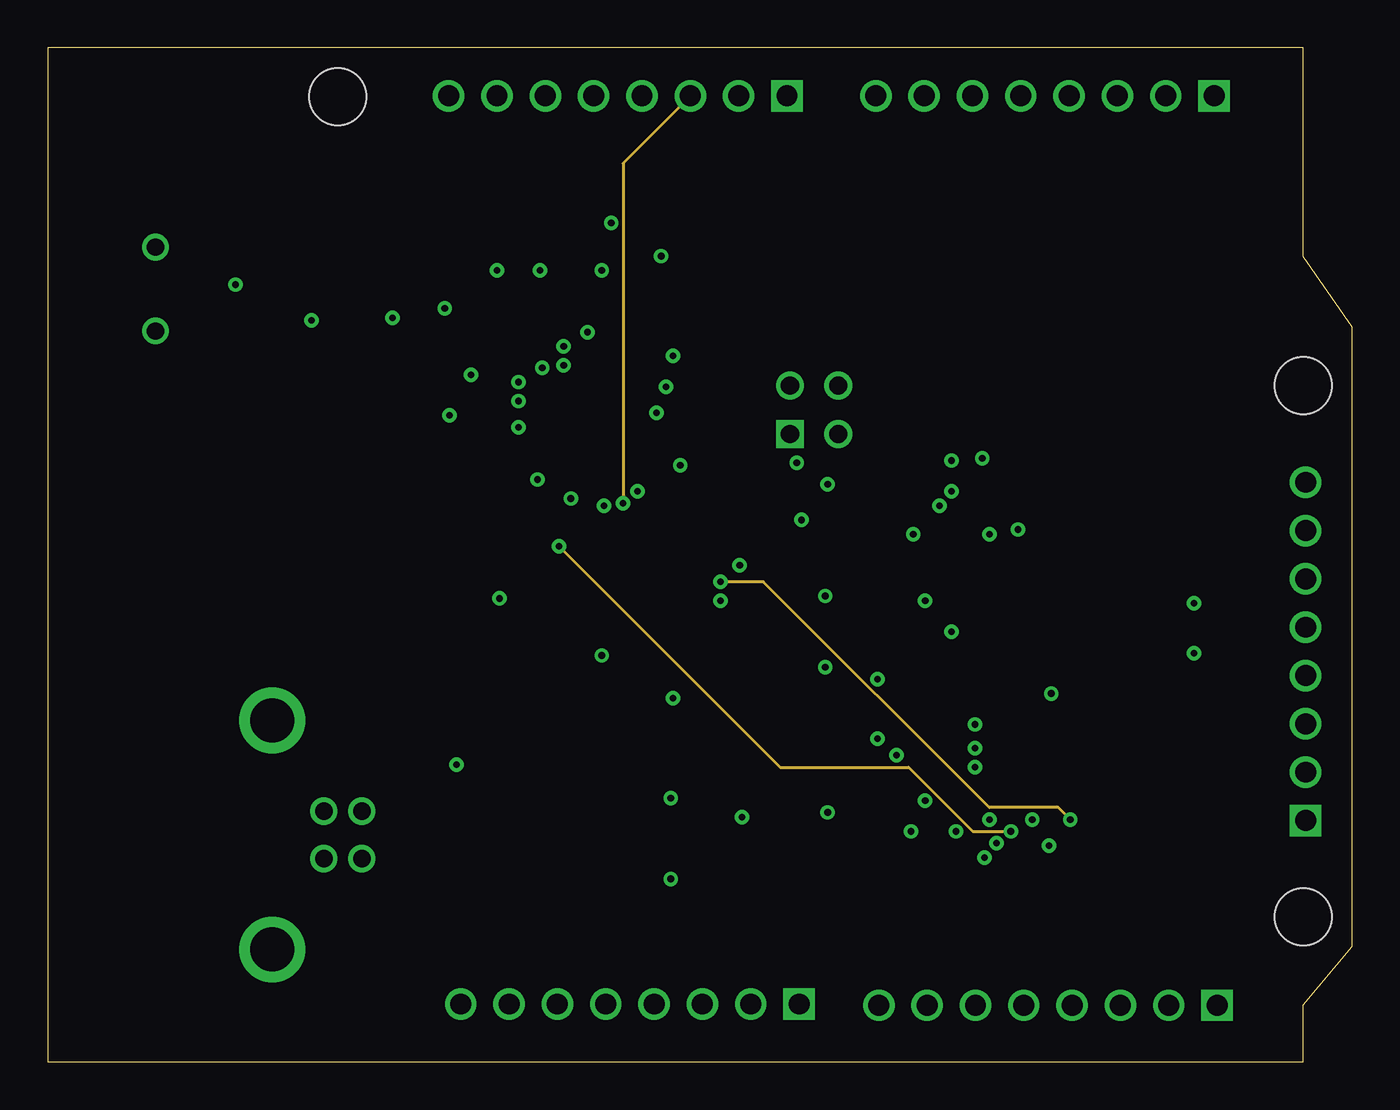
[diagram p5: board, inner layer Route15]
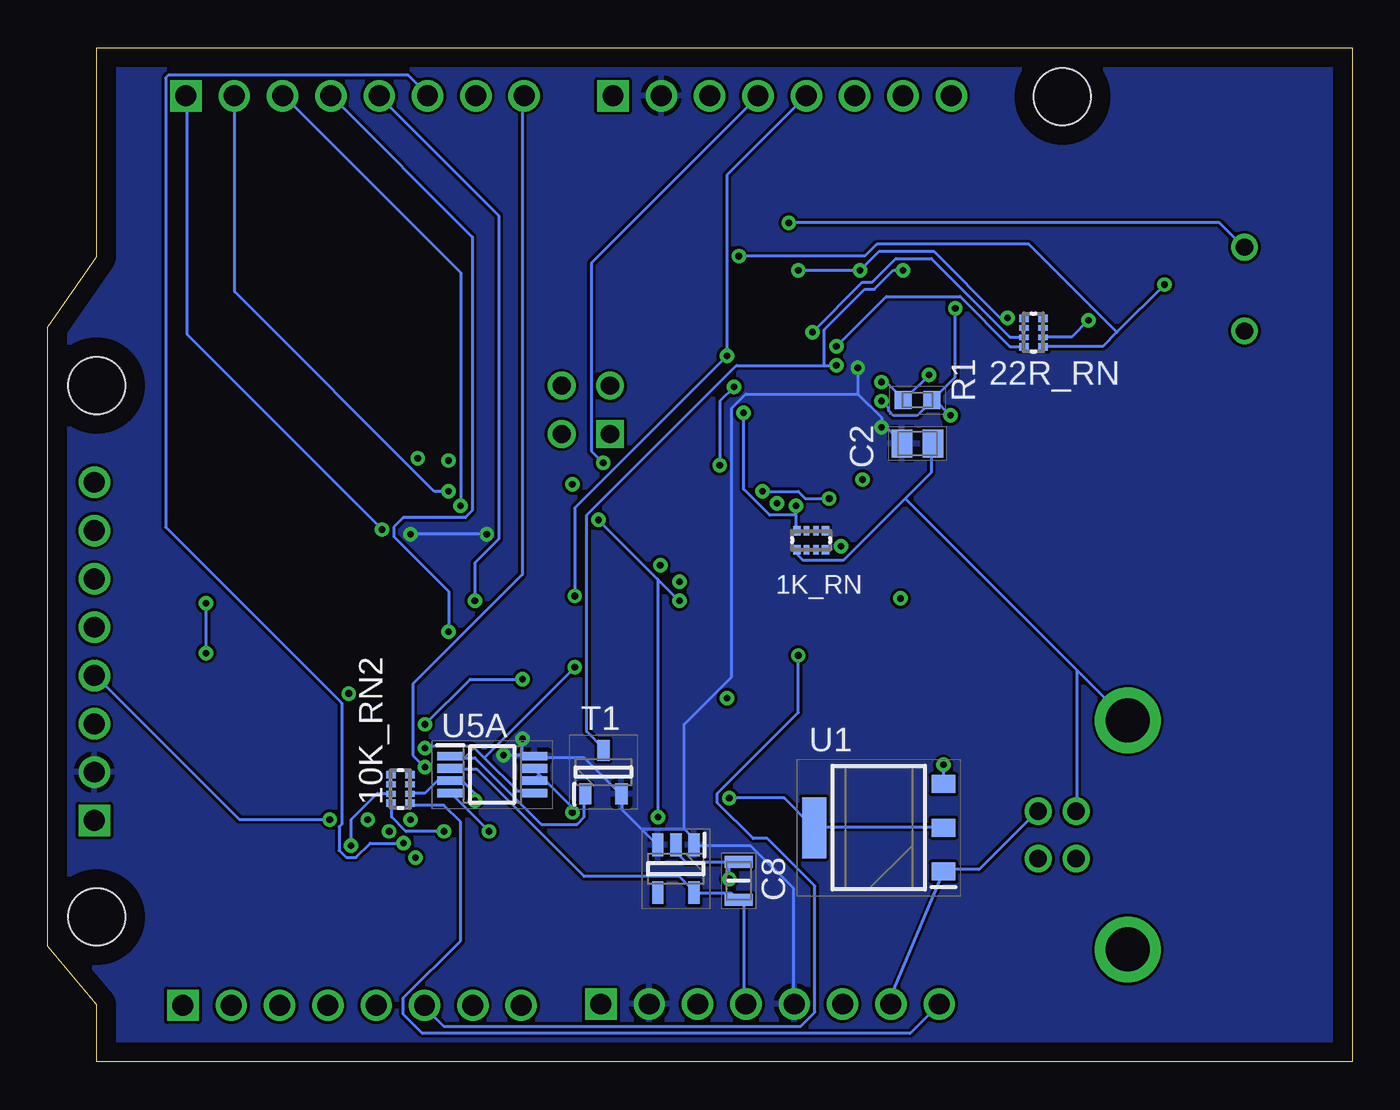
[diagram p6: board, bottom side, seen from below]

Size 68.58 x 53.34 mm. Coordinates in mm from the lower left corner, seen from the top.
Outline: 0,53.34 0,0 66,0 66,3 68.58,6.08 68.58,38.63 66,42.34 66,53.34 0,53.34
Copper layers (1+2*15+16): Top 0.036mm / dielectric 0.010159375mm / Route2 0.036mm / dielectric 10mil / Route15 0.036mm / dielectric 0.010159375mm / Bottom 0.036mm
Design rules "default *": minimum track width 6mil, minimum drill 0.35mm, track to track 6mil, track to pad 6mil, pad to pad 6mil, via to via 6mil, smd to smd 6mil, copper to edge 40mil, drill to drill 6mil, minimum pad ring 10mil, minimum via ring 8mil, stop-mask expansion 4mil, vias tented up to drill 0mil, thermal gap 10mil
Holes 3 mm at 66,35.56 66,7.62 15.24,50.76

### Footprints (pad centres in the part's own frame; a part is rotated, then mirrored left to right if it is on the bottom)
CAY10-XXXJ4 = smd 0.4 x 0.5: 1 -0.75,-0.5; 4 0.75,-0.5; 5 0.75,0.5; 8 -0.75,0.5 | smd 0.3 x 0.5: 2 -0.25,-0.5; 3 0.25,-0.5; 6 0.25,0.5; 7 -0.25,0.5
FTMH10503LDV = smd 0.56 x 2.41: 1 -2,-1.78; 2 -2,1.78; 3 -1,-1.78; 4 -1,1.78; 5 0,-1.78; 6 0,1.78; 7 1,-1.78; 8 1,1.78; 9 2,-1.78; 10 2,1.78
HDRV8W90P0X254_1X8_2032X249X56 = drill 1.1 pad 1.65 square: 1 0,0 | drill 1.1 pad 1.65: 2 2.54,0; 3 5.08,0; 4 7.62,0; 5 10.16,0; 6 12.7,0; 7 15.24,0; 8 17.78,0
BEADC2012X105N = smd 1.15 x 1.45: 1 -0.9,0; 2 0.9,0
CAPC2012X130N = smd 1.07 x 1.47: 1 -0.82,0; 2 0.82,0
CAPC2012X70N = smd 0.91 x 1.39: 1 -0.82,0; 2 0.82,0
CAPC2012X145N = smd 0.62 x 1.47: 1 -1,0; 2 1,0
DIOC3016X65N = smd 1 x 1.75: 1 -1.45,0; 2 1.45,0
FUSC4632X75N = smd 1.53 x 3.43: 1 -1.96,0; 2 1.96,0
HDRV4W77P254_2X2_467X488X821P = drill 0.95 pad 1.425 square: 1 0,0 | drill 0.95 pad 1.425: 2 0,2.54; 3 2.54,0; 4 2.54,2.54
SML522MD8WT86 = smd 0.925 x 0.4: 1 0.375,0.45; 2 -1.15,0.45; 3 0.375,-0.45; 4 -1.15,-0.45
CAPAE530X610N = smd 3 x 1.8: 1 -2.55,0; 2 2.55,0
RESC1608X55N = smd 0.9 x 0.95: 1 -0.75,0; 2 0.75,0
SOT95P240X110-3N = smd 1.321 x 0.559: 1 -1.092,0.94; 2 -1.092,-0.94; 3 1.092,0
SOT95P251X112-3N = smd 1.1 x 0.65: 1 -1.15,0.95; 2 -1.15,-0.95; 3 1.15,0
SOT230P700X180-4N = smd 1.25 x 0.95: 1 -3.4,2.3; 2 -3.4,0; 3 -3.4,-2.3 | smd 1.25 x 3.2: 4 3.4,0
SOT95P280X145-5N = smd 1.2 x 0.6: 1 -1.25,0.95; 2 -1.25,0; 3 -1.25,-0.95; 4 1.25,-0.95; 5 1.25,0.95
QFN50P500X500X100-33N = smd 0.85 x 0.3: 1 -2.45,1.75; 2 -2.45,1.25; 3 -2.45,0.75; 4 -2.45,0.25; 5 -2.45,-0.25; 6 -2.45,-0.75; 7 -2.45,-1.25; 8 -2.45,-1.75; 17 2.45,-1.75; 18 2.45,-1.25; 19 2.45,-0.75; 20 2.45,-0.25; 21 2.45,0.25; 22 2.45,0.75; 23 2.45,1.25; 24 2.45,1.75 | smd 0.3 x 0.85: 9 -1.75,-2.45; 10 -1.25,-2.45; 11 -0.75,-2.45; 12 -0.25,-2.45; 13 0.25,-2.45; 14 0.75,-2.45; 15 1.25,-2.45; 16 1.75,-2.45; 25 1.75,2.45; 26 1.25,2.45; 27 0.75,2.45; 28 0.25,2.45; 29 -0.25,2.45; 30 -0.75,2.45; 31 -1.25,2.45; 32 -1.75,2.45 | smd 3.7 x 3.7: 33 0,0
SOP65P490X110-8N = smd 1.4 x 0.45: 1 -2.2,0.975; 2 -2.2,0.325; 3 -2.2,-0.325; 4 -2.2,-0.975; 5 2.2,-0.975; 6 2.2,-0.325; 7 2.2,0.325; 8 2.2,0.975
USBBSRA = drill 0.92 pad 1.431: 1 -1.25,6.74; 2 1.25,6.74; 3 -1.25,4.74; 4 1.25,4.74 | drill 2.3 pad 3.45: 5 -6.02,2.03; 6 6.02,2.03
17340351 = smd 2.3 x 0.5: 1 0.55,1.6; 2 0.55,0.8; 3 0.55,0; 4 0.55,-0.8; 5 0.55,-1.6 | smd 2.5 x 2: 6 0.55,4.45; 7 0.55,-4.45; 8 -4.95,4.45; 9 -4.95,-4.45 | drill 0.9 pad 1.4: 10 -1.95,2.2; 11 -1.95,-2.2
CSTCE-V = smd 0.7 x 1.6: 1 0.95,0; 3 -0.95,0 | smd 0.5 x 1.6: 2 0,0
MODEL-445 = smd 1.8 x 2.4: 1 -1.9,0; 2 1.9,0
VARC1608X55N = smd 0.95 x 1: 1 -0.8,0; 2 0.8,0
QFP80P900X900X120-32N = smd 1.5 x 0.6: 1 -4.25,2.8; 2 -4.25,2; 3 -4.25,1.2; 4 -4.25,0.4; 5 -4.25,-0.4; 6 -4.25,-1.2; 7 -4.25,-2; 8 -4.25,-2.8; 17 4.25,-2.8; 18 4.25,-2; 19 4.25,-1.2; 20 4.25,-0.4; 21 4.25,0.4; 22 4.25,1.2; 23 4.25,2; 24 4.25,2.8 | smd 0.6 x 1.5: 9 -2.8,-4.25; 10 -2,-4.25; 11 -1.2,-4.25; 12 -0.4,-4.25; 13 0.4,-4.25; 14 1.2,-4.25; 15 2,-4.25; 16 2.8,-4.25; 25 2.8,4.25; 26 2,4.25; 27 1.2,4.25; 28 0.4,4.25; 29 -0.4,4.25; 30 -1.2,4.25; 31 -2,4.25; 32 -2.8,4.25

### Placement (x,y rotation side)
1K_RN  28.45,27.43 0 bottom
1K_RN2A  40.26,6.99 180 top
1K_RN4  49.02,29.21 180 top
10H  27.3,24.26 270 top
10K_RN  36.7,24.51 90 top
10K_RN2  50.04,14.35 90 bottom
22R_RN  16.76,38.35 90 bottom
AD  61.47,2.98 180 top
BEAD1  23.75,39.5 180 top
BEED2  53.34,29.21 270 top
C1  53.34,34.29 270 top
C2  22.86,32.51 180 bottom
C4  19.05,40.64 0 top
C5  30.48,38.1 0 top
C6  60.96,25.4 0 top
C7  49.53,8.89 0 top
C8  32.26,9.53 270 bottom
C9  34.29,17.78 180 top
C10  20.32,29.21 0 top
C11  43.81,22.37 270 top
D2  43.94,27.81 90 top
D3  24.26,17.4 270 top
D_3  39.24,25.91 270 top
F1  21.59,44.07 0 top
ICSP  66.12,12.7 90 top
ICSP1  38.86,50.8 180 top
IOL  61.31,50.8 180 top
JP2  39.02,33.02 0 top
L  44.45,8 90 top
L1  31.75,40.64 0 top
LED1  48.26,33.02 0 top
PC1  24.77,10.16 0 top
PC2  34.29,11.43 270 top
POWER  39.5,3.05 180 top
R1  22.86,34.8 180 bottom
R2  42.67,18.54 270 top
RESET  57.15,30.48 0 top
T1  39.37,15.24 90 bottom
U1  24.89,12.32 180 bottom
U2  35.56,10.16 270 bottom
U3  28.19,33.15 0 top
U5A  45.21,15.11 0 bottom
X1  9.78,11.94 270 top
X2  7.62,40.64 0 top
XT  40.64,18.54 90 top
XTI  20.32,34.29 90 top
Z1  35.43,40.13 90 top
Z2  37.47,40.13 90 top
ZU4  51.64,18.3 0 top

### Tracks (layer width: path | path; a pad name or v marks a point on that pad's centre or on a via)
1K_R1
  Top 0.152: 1K_RN4.1 49.75,29.75 49.75,33.38 49.12,34 47.62,34 47.12,33.5 LED1.2
1K_R2
  Top 0.152: 1K_RN4.2 49.25,29.75 49.25,30.75 47.5,32.5 47.12,32.5 LED1.4
+3V3
  Bottom 0.152: U5A.2 47.38,15.38 46,15.38 40.38,9.75 35.38,9.75 34.62,9 U2.5 34.5,8.88 32.62,8.88 32.38,8.62 C8.2 32.25,8.5 32,8.25 32,3.12 POWER.4
+5V  (via drill 0.35)
  Top 0.152: v24.75,33.38 25.62,33.38 U3.4 | 26.5,36.5 26.5,41.88 35.38,50.75 36.25,50.75 ICSP1.2 | 26.5,36.5 26.5,35.62 U3.32 | 26.5,36.5 v26,36.5 | RESET.2 56,29.5 56,29.25 54.25,27.5 52.5,27.5 51.38,28.62 49.88,28.62 1K_RN4.8 49.75,28.75 49.38,28.75 1K_RN4.7 49.38,28.62 49.38,27.88 v49.5,27.75 | 46,19.38 46.62,18.75 47.38,18.75 ZU4.4 | 46,19.38 43.88,21.5 C11.2 43.75,21.62 42.75,22.62 42.75,26.38 | 10K_RN.1 37.25,23.88 37.25,24.25 10K_RN.2 37.25,24.38 37.62,24.38 38.12,24.88 38.12,26.25 38.25,26.38 | 38.25,26.38 39.12,27.25 D_3.1 | 38.25,26.38 42.75,26.38 | 42.75,26.38 43.88,26.38 D2.1 44,26.25 v45.5,27.75 | 46.38,16.12 46.38,16.75 46.62,17 47.38,17 ZU4.6 47.5,17.12 49,17.12 49.75,16.38 55.88,16.38 ZU4.18 56,16.25 56.62,16.25 57.62,15.25 66,15.25 ICSP.2 | 46.38,16.12 46.38,14.5 48.62,12.25 48.62,9 C7.1 | 1K_RN2A.2 40.12,7.5 1K_RN2A.3 40,7.38 40,7.12 39.88,7 39.25,7 37,4.75 37,3.12 POWER.2 36.88,3 35.75,1.88 31.5,1.88 30.38,3 29.38,3 POWER.5 | v44.62,16.12 46.38,16.12 | v43.62,17 46,19.38
  Bottom 0.152: C2.2 23.75,32.62 24.5,33.38 v24.75,33.38 24.75,33.88 26,35.12 | v26,36.5 26,35.12 | v45.5,27.75 v49.5,27.75 | 37.38,12.25 36.62,11.5 U2.3 | 37.38,12.25 38.38,13.25 38.38,14 T1.2 38.5,14.12 40.38,16 43,16 U5A.8 | 35.12,12.25 34.62,11.75 34.62,11.5 U2.1 34.5,11.38 31.62,11.38 29.38,9.12 29.38,3.12 POWER.5 | 37.38,12.25 35.12,12.25 | 43.62,16.12 43.12,16.12 U5A.8 | 43.62,16.12 v44.62,16.12 | 43.62,16.12 v43.62,17 | 43.62,16.12 U5A.8 | 26,35.12 31.88,35.12 32.62,34.38 32.62,20.25 35.12,17.75 35.12,12.25
  pour Bottom: 0,53.34 0,0 66.04,0 66.04,2.54 68.58,5.08 68.58,39.37 66.04,41.91 66.04,53.34
AD4/SDA  (via drill 0.35)
  Top 0.152: v52.75,19.38 52.75,22.5 ZU4.27 | v32.88,19.12 29.88,19.12 26.75,22.25 25.62,22.25 10H.9
  Route2 0.152: v52.75,19.38 52.75,12.38 51.38,11 51.38,7.12 | 51.38,7.12 51.38,3 AD.5 | v32.88,19.12 39.38,19.12 51.38,7.12
AD5/SCL  (via drill 0.35)
  Top 0.152: v29.12,21.38 29.12,22.25 10H.10
  Bottom 0.152: v29.12,21.38 29.12,18.38 33.38,14.12 33.38,13.62 31.5,11.75 30.75,11.75 28.25,9.25 28.25,2.62 29,1.88 47.75,1.88 48.75,2.88 AD.6
AREF  (via drill 0.35)
  Top 0.152: v60.25,24.12 60.25,25.38 C6.1 | v60.25,21.5 56.75,18 56,18 ZU4.20 55.88,17.88 55.75,17.75 v48.75,17.75 | v43.62,20.12 38.12,20.12 35,23.25 29.12,23.25 10H.8
  Bottom 0.152: v60.25,21.5 v60.25,24.12 | v43.62,20.12 46.38,20.12 v48.75,17.75
CMP  (via drill 0.35)
  Top 0.152: v46.12,13.75 v47.75,12.12
  Bottom 0.152: v47.75,12.12 49.75,12.12 50.5,12.88 50.5,13.5 10K_RN2.8 | v46.12,13.75 46.12,14.12 46.75,14.75 47.38,14.75 U5A.3 47.5,14.75 48.12,14.75 48.75,14.12 49.5,14.12 10K_RN2.2
D+  (via drill 0.35)
  Top 0.152: X2.3 8.25,40.62 9.12,40.62 10.75,39 v13.88,39 16.5,41.62 20,41.62 22.25,43.88 22.25,51 23.12,51.88 36.75,51.88 37.5,51.12 37.5,50.12 38.25,49.38 38.25,40.38 38,40.12 36.88,40.12 36.12,40.88 35.5,40.88 Z1.2
  Bottom 0.152: v13.88,39 14.75,38.12 16.25,38.12 22R_RN.2
D-  (via drill 0.35)
  Top 0.152: v9.88,40.88 9.38,41.38 8.25,41.38 X2.2 | v32.25,42.38 35.38,42.38 36.75,41 37.38,41 Z2.2
  Bottom 0.152: v9.88,40.88 12.38,38.38 | 12.38,38.38 13.12,37.62 16.25,37.62 22R_RN.1 | v32.25,42.38 25.62,42.38 25,43 17,43 12.38,38.38
DTR  (via drill 0.35)
  Top 0.152: v29.25,29.25 28.5,30 28.5,30.62 U3.13 | v32,34.12 34.88,37 41.5,37 43.38,35.12 53.25,35.12 C1.1
  Bottom 0.152: v29.25,29.25 29.25,28.75 | 29.25,28.75 29.25,28 1K_RN.8 | v32,34.12 32,30.12 30.62,28.75 29.25,28.75
GATE_CMD
  Bottom 0.152: T1.1 40.38,14 40.38,12.88 40.75,12.5 42.62,12.5 46.12,16 47.38,16 U5A.1
GND  (via drill 0.35)
  Top 0.152: RESET.3 58.25,30.38 58.25,29 61.75,25.5 C6.2 | ICSP.6 66,25.5 61.88,25.5 C6.2 | C11.1 43.88,23.12 45.75,21.25 45.75,20.5 46.75,19.5 ZU4.3 48,19.5 48.38,19.12 48.38,18.75 | 48.38,18.75 48.38,18.25 48.12,18 47.5,18 ZU4.5 47.38,17.88 45.38,17.88 42.88,15.38 | 48.38,18.75 55.88,18.75 ZU4.21 56,18.75 56.62,18.75 61.75,23.88 61.75,25.38 C6.2 | L.1 44.88,8.38 L.3 45,8.38 45.38,8.38 | v52.62,11.38 50.25,9 C7.2 50.38,8.88 49.38,7.88 48.12,7.88 47.62,8.38 45.38,8.38 | 45.38,8.38 v45.38,12.12 45.38,12.88 42.88,15.38 | 33.62,9.62 v32.75,9.62 | 33.62,9.62 34.25,9 PC2.2 33.62,9.62 | 34.25,18.62 34.38,18.75 35.88,18.75 | 34.25,18.62 33.5,17.88 C9.2 | 35.88,18.75 39,18.75 40.12,17.62 40.62,17.62 XT.3 40.75,17.5 42.88,15.38 | 26.38,23.25 25.62,23.25 10H.7 26.38,23.25 | 26.38,23.25 27.62,22 27.62,21.88 29.75,19.75 33.12,19.75 34.25,18.62 | 33.62,9.62 33.62,10.5 35.88,12.75 35.88,18.75 | U3.33 28.12,33.25 27.5,33.88 25.75,33.88 U3.3 25.62,34 24.62,34 22.88,35.75 22.88,39.38 BEAD1.2 | 18.88,40 19.88,39 22.38,39 22.75,39.38 BEAD1.2 | 18.88,40 18.25,40.62 C4.1 | 18.88,40 18.88,31.38 19.5,30.75 C10.1 19.5,27.75 | ICSP1.6 26.12,50.75 26.12,42.75 22.88,39.5 BEAD1.2 | PC1.2 27.25,10.12 27.25,3.5 26.88,3.12 POWER.6 26.75,3.12 24.38,3.12 POWER.7 | X1.1 16.5,13.25 14.62,13.25 X1.3 14.5,13.12 14.5,10.75 X1.4 14.5,10.62 11.88,8 11.88,6 X1.6 | 19.5,27.75 19.5,25.62 11.88,18 X1.5 | 26.38,23.25 27.5,24.38 27.5,27.38 27.12,27.75 19.5,27.75
  Bottom 0.152: v52.62,11.38 52.62,12.75 51.25,14.12 50.62,14.12 10K_RN2.7 | v45.38,12.12 47.38,14.12 U5A.4 | 32.75,10.5 32.38,10.5 C8.1 32.75,10.5 | 32.75,10.5 35,10.5 35.5,11 35.5,11.38 U2.2 | v32.75,9.62 32.75,10.5 | X1.1 16.62,13.12 19.62,10.12 21.38,10.12 U1.1 24.25,3.47 24.25,3.12 POWER.7 | 23.5,29.62 22.12,31 22.12,32.5 C2.1 | 23.5,29.62 26.75,26.38 28.88,26.38 29.12,26.62 29.12,26.88 1K_RN.1 | 14.5,20.62 11.88,18 X1.5 | 14.5,20.62 23.5,29.62 | 14.5,20.62 14.5,13.25 X1.3
  pour Top: 0,53.34 0,0 66.04,0 66.04,2.54 68.58,5.08 68.58,6.35 68.58,38.1 68.58,39.37 66.04,41.91 66.04,53.34
GREENLED
  Top 0.152: 1K_RN2A.6 40.12,6.5 1K_RN2A.7 40.5,6.38 40.5,6.12 40.62,6 44.25,6 45,6.75 L.4
IO0  (via drill 0.35)
  Top 0.152: 48.88,25.88 48.88,25.38 50.38,23.88 50.38,22.62 ZU4.30 | 48.88,25.88 48.88,28.62 1K_RN4.6 | 48.88,25.88 v51,28
  Bottom 0.152: v51,28 61.25,38.25 61.25,50.75 IOL.1
IO1  (via drill 0.35)
  Top 0.152: ZU4.31 49.62,22.62 49.62,24.12 48.38,25.38 48.38,28.62 1K_RN4.5 48.25,28.75 47.5,29.5 v47.5,30
  Bottom 0.152: v47.5,30 48.25,30 58.75,40.5 58.75,50.75 IOL.2
IO2  (via drill 0.35)
  Top 0.152: v46.88,29.25 46.88,26.38 48.75,24.5 48.75,22.62 ZU4.32
  Bottom 0.152: v46.88,29.25 46.88,41.5 56.12,50.75 IOL.3
IO3  (via drill 0.35)
  Top 0.152: v47.5,22.62 47.5,21.12 ZU4.1
  Bottom 0.152: v47.5,22.62 47.5,24.75 50.38,27.62 50.38,28.12 49.88,28.62 46.62,28.62 46.25,29 46.25,43.38 53.62,50.75 IOL.4
IO4  (via drill 0.35)
  Top 0.152: v46.12,24.25 46.12,20.88 46.62,20.38 47.38,20.38 ZU4.2
  Bottom 0.152: v46.12,24.25 46.12,26.25 44.88,27.5 44.88,44.5 51.12,50.75 IOL.5
IO5  (via drill 0.35)
  Top 0.152: v49.88,11.5 48.88,12.5 48.88,14 ZU4.9
  Bottom 0.152: v49.88,11.5 51.62,11.5 52.38,10.75 52.88,10.75 53.25,11.12 53.25,12.38 53.12,12.5 53.12,18.88 62.38,28.12 62.38,51.75 62.25,51.88 49.62,51.88 48.62,50.88 IOL.6
IO6  (via drill 0.35)
  Top 0.152: v49.5,12.75 49.62,12.88 49.62,14 ZU4.10
  Route2 0.152: v49.5,12.75 49.5,25.75 46.12,29.12 46.12,50.75 IOL.7
IO7  (via drill 0.35)
  Top 0.152: v48.75,15.5 49.62,15.5 50.38,14.75 50.38,14.12 ZU4.11
  Bottom 0.152: v48.75,15.5 49.38,16.12 49.38,19.88 43.62,25.62 43.62,50.75 IOL.8
IO8  (via drill 0.35)
  Top 0.152: v50.62,12.12 51.12,12.62 51.12,14 ZU4.12 | v26.88,27.12 26.38,27.12 25.62,26.38 10H.1
  Route15 0.152: v50.62,12.12 48.62,12.12 45.25,15.5 38.5,15.5 v26.88,27.12
IO9  (via drill 0.35)
  Top 0.152: v51.75,12.75 52,13 52,14 ZU4.13 | v36.38,26.12 29.25,26.12 29.12,26.25 10H.2
  Route2 0.152: v51.75,12.75 50.38,12.75 49.75,12.12 49.25,12.12 45.25,16.12 45.25,17.25 v36.38,26.12
L13  (via drill 0.35)
  Top 0.152: v41,13.12 1K_RN2A.1
  Bottom 0.152: v41,13.12 41,13.38 42.75,15.12 | 42.75,15.12 43,15.38 U5A.7 | 42.75,15.12 43,14.88 U5A.6
M8RXD
  Top 0.152: 1K_RN4.3 48.75,29.75 48.75,30.12 47.88,31 40.75,31 38,28.25 27.5,28.25 26.5,29.25 26.5,30.62 U3.9
M8TXD  (via drill 0.35)
  Top 0.152: v41,30.38 41.25,30.62 47.75,30.62 48.25,30.12 48.25,29.75 1K_RN4.4 | v25.75,30.62 25.75,31.38 U3.8
  Route2 0.152: v41,30.38 31.88,30.38 31.62,30.62 v25.75,30.62
MISO
  Top 0.152: 57.12,14 57.25,14 58.5,12.75 66,12.75 ICSP.1 | 57.12,14 54.5,14 ZU4.16 | 57.12,14 50.62,7.5 46.62,7.5 40.62,1.5 29.38,1.5 28.25,2.62 28.25,3.5 29.12,4.38 29.12,15.75 24,20.88 24,23.62 24.62,24.25 25.5,24.25 10H.5
MISO2  (via drill 0.35)
  Top 0.152: v33.25,31.38 30.75,31.38 U3.17 | v32.5,35.5 32.88,35.5 36,38.62 38.12,38.62 38.75,39.25 38.75,50.75 ICSP1.1
  Bottom 0.152: v33.25,31.38 33.25,34.75 v32.5,35.5
MOSI  (via drill 0.35)
  Top 0.152: v53.75,12.75 53.75,14 ZU4.15 | v35.38,25.25 29.12,25.25 10H.4
  Route15 0.152: v35.38,25.25 37.62,25.25 49.5,13.38 53.12,13.38 v53.75,12.75
  Bottom 0.152: v53.75,12.75 58.5,12.75 66,20.25 ICSP.4
MOSI2  (via drill 0.35)
  Top 0.152: v39.38,31.5 38.62,30.75 30,30.75 U3.16
  Bottom 0.152: v39.38,31.5 40,32.12 40,42 31.25,50.75 ICSP1.4
N$3
  Top 0.152: 1K_RN2A.8 41.12,6.5 43.75,6.5 44,6.75 L.2
N$4  (via drill 0.35)
  Top 0.152: v21.5,15.62 21.5,16 24.25,18.75 D3.1
  Bottom 0.152: v21.5,15.62 U1.3
N$6  (via drill 0.35)
  Top 0.152: C9.1 35,17.75 35,14.62 34.38,14 PC2.1 34.25,13.88 v32.75,13.88
  Bottom 0.152: U1.2 21.5,12.38 28.25,12.38 U1.4 28.38,12.38 29.88,13.88 v32.75,13.88
PB4
  Top 0.152: JP2.1 38,32 30.75,32 U3.18
PB5
  Top 0.152: U3.19 30.75,32.5 36.62,32.5 38.12,34 40.62,34 41.5,33.12 JP2.3
PB6
  Top 0.152: U3.20 30.75,33 36.5,33 39,35.5 JP2.2
PB7
  Top 0.152: U3.21 30.75,33.5 35.5,33.5 38.62,36.62 40.5,36.62 41.5,35.62 JP2.4
PWRIN
  Top 0.152: 22.62,10.62 22.25,10.25 PC1.1 22.62,10.62 | 22.62,10.62 24.25,12.25 24.25,15.88 D3.2 | 22.62,10.62 16.62,10.62 X1.2
RD+  (via drill 0.35)
  Top 0.152: v28.38,38.38 28.38,37.12 28.12,36.88 28.12,36.25 28,36.12 28,35.62 U3.29
  Bottom 0.152: v28.38,38.38 25.75,41 25.25,41 24,42.25 22.12,42.25 18,38.12 17.38,38.12 22R_RN.7
RD-  (via drill 0.35)
  Top 0.152: v27.12,37.62 27.75,37 27.75,36.38 27.5,36.12 27.5,35.62 U3.30
  Bottom 0.152: v27.12,37.62 24.5,40.25 20.62,40.25 18,37.62 17.38,37.62 22R_RN.8
RESET  (via drill 0.35)
  Top 0.152: 55.38,31.38 54.62,31.38 53.38,30.12 BEED2.1 53.38,30 53.38,28.38 BEED2.2 | 55.38,31.38 56,31.38 RESET.1 56.12,31.38 57,30.5 57,29.12 51.25,23.38 51.25,22.62 ZU4.29 51.12,22.5 51.12,21.75 50.88,21.5 48.5,21.5 48.12,21.88 48.12,24.62 46.12,26.62 46.12,28 44.88,29.25 44,29.25 D2.2 43.88,29.25 43.12,28.5 v39.62,28.5 | 55.38,31.38 55.12,31.62 | 55.12,31.62 53.38,33.38 C1.2 | 55.12,31.62 66.5,31.62 67.25,30.88 67.25,25 66.12,23.88 66.12,22.88 ICSP.5 | v35.38,24.25 36.12,24.25 10K_RN.7 | v36.5,12.88 36.5,8.25 34.5,6.25 34.5,3.12 POWER.3
  Bottom 0.152: v39.62,28.5 36.5,25.38 | 36.5,25.38 v35.38,24.25 | 36.5,25.38 v36.5,12.88
RESET2  (via drill 0.35)
  Top 0.152: 10K_RN.8 36.25,23.75 36.75,23.25 38,23.25 39.12,24.38 D_3.2 39.25,24.5 v40.88,24.5 | v32.88,37.12 30.75,35 U3.24
  Bottom 0.152: ICSP1.5 28.75,50.75 32.88,46.62 v32.88,37.12 40.88,29.12 v40.88,24.5
RXLED  (via drill 0.35)
  Top 0.152: v47.5,31.62 40.88,31.62 37.88,28.62 27.62,28.62 26.88,29.38 26.88,30.62 U3.10 | v49.12,31.75 49.12,32.12 48.75,32.5 LED1.3
  Route2 0.152: v47.5,31.62 49,31.62 v49.12,31.75
SCK  (via drill 0.35)
  Top 0.152: v48.75,16.5 49.12,16.5 50.12,15.5 ZU4.17 56.25,15.5 57.62,14.12 66.5,14.12 67.25,14.88 67.25,15.62 66.12,16.75 66.12,17.75 ICSP.3 | v40.88,20.75 38,20.75 34.5,24.25 29.12,24.25 10H.6
  Bottom 0.152: 45.62,16 46.25,16.62 48.62,16.62 v48.75,16.5 | 45.62,16 43.88,14.25 43.12,14.25 U5A.5 | 45.62,16 v40.88,20.75
SCK2  (via drill 0.35)
  Top 0.152: v30.25,29.38 29.5,30.12 29.5,30.62 U3.15
  Route15 0.152: v30.25,29.38 30.25,47.25 33.75,50.75 ICSP1.3
SS  (via drill 0.35)
  Top 0.152: v49.25,10.75 50.62,10.75 52.75,12.88 52.75,14 ZU4.14 | v23.75,24.38 24.62,25.25 25.5,25.25 10H.3
  Route2 0.152: v49.25,10.75 48.25,10.75 35.38,23.62 24.5,23.62 v23.75,24.38
TP_VUCAP
  Top 0.152: U3.27 29,35.62 29,36.12 30.88,38 31.38,38 C5.2
TXLED  (via drill 0.35)
  Top 0.152: v27.5,29.62 27.5,30.62 U3.11 | v31,30 38.75,30 40.75,32 45.5,32 46.5,33 48.25,33 48.62,33.38 LED1.1
  Bottom 0.152: v27.5,29.62 28.75,29.62 29.12,30 v31,30
UGND  (via drill 0.35)
  Top 0.152: U3.28 28.5,35.62 28.5,36.75 29.38,37.62 29.38,38 C5.1 29.5,38.12 29.5,41.62 | v25.88,41.62 24.75,40.5 24.75,39.5 BEAD1.1 | 29.5,41.62 29.88,41.62 30.75,40.75 L1.1 | v18.12,39.12 17.38,38.38 10.88,38.38 9.5,39.75 8.25,39.75 X2.4 | 29.5,41.62 v29.12,41.62
  Bottom 0.152: v29.12,41.62 v25.88,41.62 24.88,42.62 22,42.62 18.5,39.12 v18.12,39.12
USBVCC  (via drill 0.35)
  Top 0.152: v27.12,36.62 27,36.5 27,35.62 U3.31 | v23.62,41.62 23.62,44 F1.2
  Bottom 0.152: 27.75,36.62 32.38,36.62 40.25,28.75 40.25,17.38 39.38,16.5 T1.3 | 27.75,36.62 v27.12,36.62 | v23.62,41.62 24.12,41.62 25.12,40.62 25.62,40.62 27.75,38.5 27.75,36.62
USHIELD  (via drill 0.35)
  Top 0.152: X2.5 8.25,39 8.25,36.25 X2.7 8.12,36.25 5.62,36.25 | 5.62,36.25 2.75,36.25 X2.9 | 5.62,36.25 5.62,38.38 X2.11 5.62,38.5 5.62,42.75 X2.10 5.62,42.88 5.62,45.12 | Z2.1 37.38,39.38 35.5,39.38 Z1.1 35.38,39.38 34.12,40.62 32.75,40.62 L1.2 32.62,40.75 32.62,41.12 v29.62,44.12 | 5.62,45.12 8.12,45.12 X2.6 | 5.62,45.12 2.75,45.12 X2.8
  Bottom 0.152: v29.62,44.12 7,44.12 5.75,42.88 X2.10
VIN
  Bottom 0.152: 10K_RN2.1 49.5,13.5 47.75,13.5 46.88,12.62 46.88,6.38 49.88,3.38 49.88,2.5 48.88,1.5 23.25,1.5 21.75,3 POWER.8
XT1  (via drill 0.35)
  Top 0.152: v24.75,35.75 25.5,35 25.62,35 U3.1 | 20.38,36.12 21.75,34.75 21.75,31.38 21.25,30.88 21.25,29.25 C10.2 | 20.38,36.12 v22.25,36.12 | 20.38,36.12 XTI.2
  Bottom 0.152: v24.75,35.75 24.5,35.75 23.62,34.88 R1.2 23.5,34.88 v22.25,36.12
XT2  (via drill 0.35)
  Top 0.152: v24.75,34.75 25,34.5 25.62,34.5 U3.2 | v20.88,39.62 19.88,40.62 C4.2 | v21.12,34 20.38,33.25 20.38,32.5 XTI.1
  Bottom 0.152: v24.75,34.75 24.38,34.38 24.38,34.25 24.12,34 22.88,34 22.12,34.75 R1.1 22,34.88 | v20.88,39.62 20.88,36 22,34.88 | 22,34.88 v21.12,34
XT2_1
  Top 0.152: R2.1 42.62,19.38 40.75,19.38 XT.1
XT2_2
  Top 0.152: R2.2 42.62,17.88 41.88,17.88 41.25,18.5 40.75,18.5 XT.2
XUSB
  Top 0.152: X2.1 8.25,42.25 17.88,42.25 19.62,44 F1.1

### Text on the board
tNames: 4 LAYERS ARDUINO TEST BOARD / / Has Clearance errors on layer-1 / and layer-16. / Autorouter is used for routing. / Width of +5V route line and +3V3 / route line should be 0.3mm but in / this design it is 0.1524mm which is / not correct.